# Altium project Time Circuit Control.PrjPcb
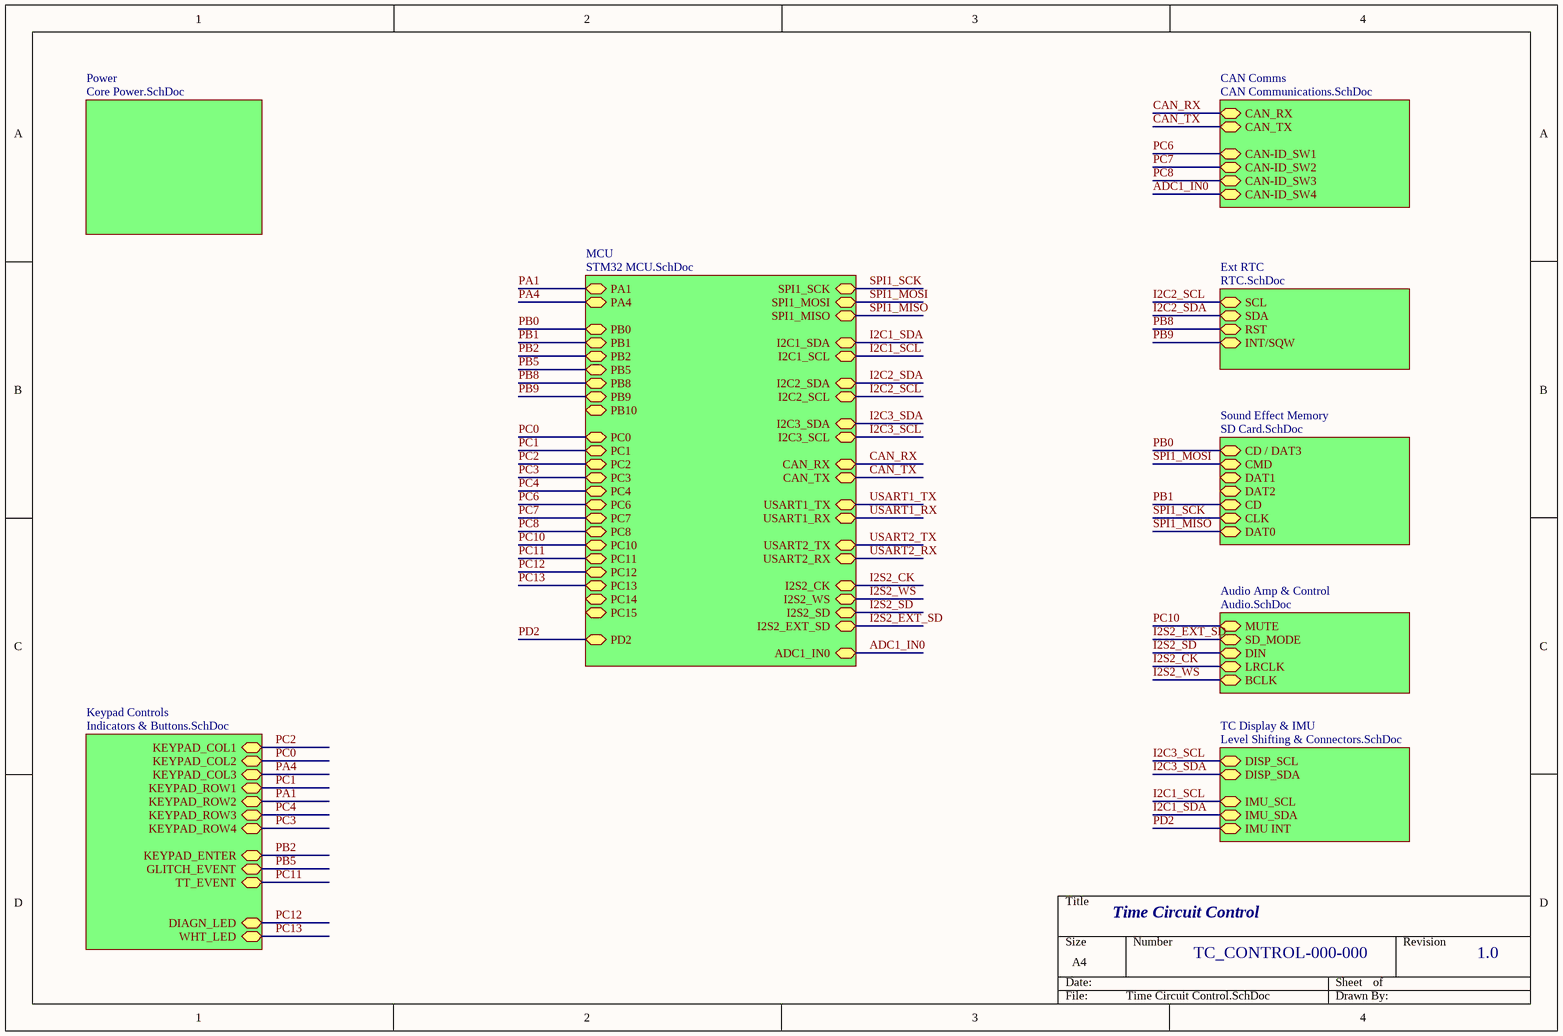
[diagram p0: Time Circuit Control.SchDoc]
9 sheets, 108 parts. Net scope: hierarchical (ports join the sheet entries above them; power ports are global).
Board file: Time Circuit Control.PcbDoc
Sheets:
  Time Circuit Control.SchDoc
    MCU = STM32 MCU.SchDoc
    CAN Comms = CAN Communications.SchDoc
    Ext RTC = RTC.SchDoc
    Power = Core Power.SchDoc
    Sound Effect Memory = SD Card.SchDoc
    Audio Amp & Control = Audio.SchDoc
    TC Display & IMU = Level Shifting & Connectors.SchDoc
    Keypad Controls = Indicators & Buttons.SchDoc

## Sheet Time Circuit Control.SchDoc
size A4; SheetNumber: 9; SheetTotal: 9

### Sub-sheets
Audio Amp & Control = Audio.SchDoc: DIN, SD_MODE, LRCLK, MUTE, BCLK
CAN Comms = CAN Communications.SchDoc: CAN_RX, CAN_TX, CAN-ID_SW1, CAN-ID_SW2, CAN-ID_SW3, CAN-ID_SW4
Ext RTC = RTC.SchDoc: SDA, RST, INT/SQW, SCL
Keypad Controls = Indicators & Buttons.SchDoc: KEYPAD_COL2, KEYPAD_ENTER, KEYPAD_COL1, GLITCH_EVENT, DIAGN_LED, KEYPAD_ROW2, KEYPAD_COL3, TT_EVENT, KEYPAD_ROW1, KEYPAD_ROW4, WHT_LED, KEYPAD_ROW3
MCU = STM32 MCU.SchDoc: SPI1_SCK, SPI1_MOSI, PA1, PA4, PC12, I2S2_CK, PC4, I2S2_WS, I2S2_SD, PD2, PC15, PC1, PC0, PC14, PC13, PB9, PB8, PC11, PC10, I2S2_EXT_SD, I2C1_SDA, I2C1_SCL, PB2, PB1, I2C2_SDA, I2C2_SCL, PB10, PB0, CAN_RX, CAN_TX, USART2_TX, PC7, PC8, I2C3_SDA, USART2_RX, PC6, I2C3_SCL, USART1_TX, USART1_RX, PB5, SPI1_MISO, PC3, PC2, ADC1_IN0
Power = Core Power.SchDoc: no entries
Sound Effect Memory = SD Card.SchDoc: CD / DAT3, CMD, DAT1, DAT2, CD, CLK, DAT0
TC Display & IMU = Level Shifting & Connectors.SchDoc: IMU INT, DISP_SDA, IMU_SDA, IMU_SCL, DISP_SCL

### Nets
ADC1_IN0: sheet MCU/ADC1_IN0, sheet CAN Comms/CAN-ID_SW4
CAN_RX: sheet MCU/CAN_RX, sheet CAN Comms/CAN_RX
CAN_TX: sheet MCU/CAN_TX, sheet CAN Comms/CAN_TX
I2C1_SCL: sheet MCU/I2C1_SCL, sheet TC Display & IMU/IMU_SCL
I2C1_SDA: sheet MCU/I2C1_SDA, sheet TC Display & IMU/IMU_SDA
I2C2_SCL: sheet MCU/I2C2_SCL, sheet Ext RTC/SCL
I2C2_SDA: sheet MCU/I2C2_SDA, sheet Ext RTC/SDA
I2C3_SCL: sheet MCU/I2C3_SCL, sheet TC Display & IMU/DISP_SCL
I2C3_SDA: sheet MCU/I2C3_SDA, sheet TC Display & IMU/DISP_SDA
I2S2_CK: sheet MCU/I2S2_CK, sheet Audio Amp & Control/LRCLK
I2S2_EXT_SD: sheet MCU/I2S2_EXT_SD, sheet Audio Amp & Control/SD_MODE
I2S2_SD: sheet MCU/I2S2_SD, sheet Audio Amp & Control/DIN
I2S2_WS: sheet MCU/I2S2_WS, sheet Audio Amp & Control/BCLK
PA1: sheet MCU/PA1, sheet Keypad Controls/KEYPAD_ROW2
PA4: sheet MCU/PA4, sheet Keypad Controls/KEYPAD_COL3
PB0: sheet MCU/PB0, sheet Sound Effect Memory/CD / DAT3
PB1: sheet MCU/PB1, sheet Sound Effect Memory/CD
PB2: sheet MCU/PB2, sheet Keypad Controls/KEYPAD_ENTER
PB5: sheet MCU/PB5, sheet Keypad Controls/GLITCH_EVENT
PB8: sheet MCU/PB8, sheet Ext RTC/RST
PB9: sheet MCU/PB9, sheet Ext RTC/INT/SQW
PC0: sheet MCU/PC0, sheet Keypad Controls/KEYPAD_COL2
PC1: sheet MCU/PC1, sheet Keypad Controls/KEYPAD_ROW1
PC2: sheet MCU/PC2, sheet Keypad Controls/KEYPAD_COL1
PC3: sheet MCU/PC3, sheet Keypad Controls/KEYPAD_ROW4
PC4: sheet MCU/PC4, sheet Keypad Controls/KEYPAD_ROW3
PC6: sheet MCU/PC6, sheet CAN Comms/CAN-ID_SW1
PC7: sheet MCU/PC7, sheet CAN Comms/CAN-ID_SW2
PC8: sheet MCU/PC8, sheet CAN Comms/CAN-ID_SW3
PC10: sheet MCU/PC10, sheet Audio Amp & Control/MUTE
PC11: sheet MCU/PC11, sheet Keypad Controls/TT_EVENT
PC12: sheet MCU/PC12, sheet Keypad Controls/DIAGN_LED
PC13: sheet MCU/PC13, sheet Keypad Controls/WHT_LED
PD2: sheet MCU/PD2, sheet TC Display & IMU/IMU INT
SPI1_MISO: sheet MCU/SPI1_MISO, sheet Sound Effect Memory/DAT0
SPI1_MOSI: sheet MCU/SPI1_MOSI, sheet Sound Effect Memory/CMD
SPI1_SCK: sheet MCU/SPI1_SCK, sheet Sound Effect Memory/CLK

### Notes on the sheet
- Time Circuit Control
- TC_CONTROL-000-000
- 1.0

## Sheet STM32 MCU.SchDoc
size A4; SheetNumber: 1; SheetTotal: 9
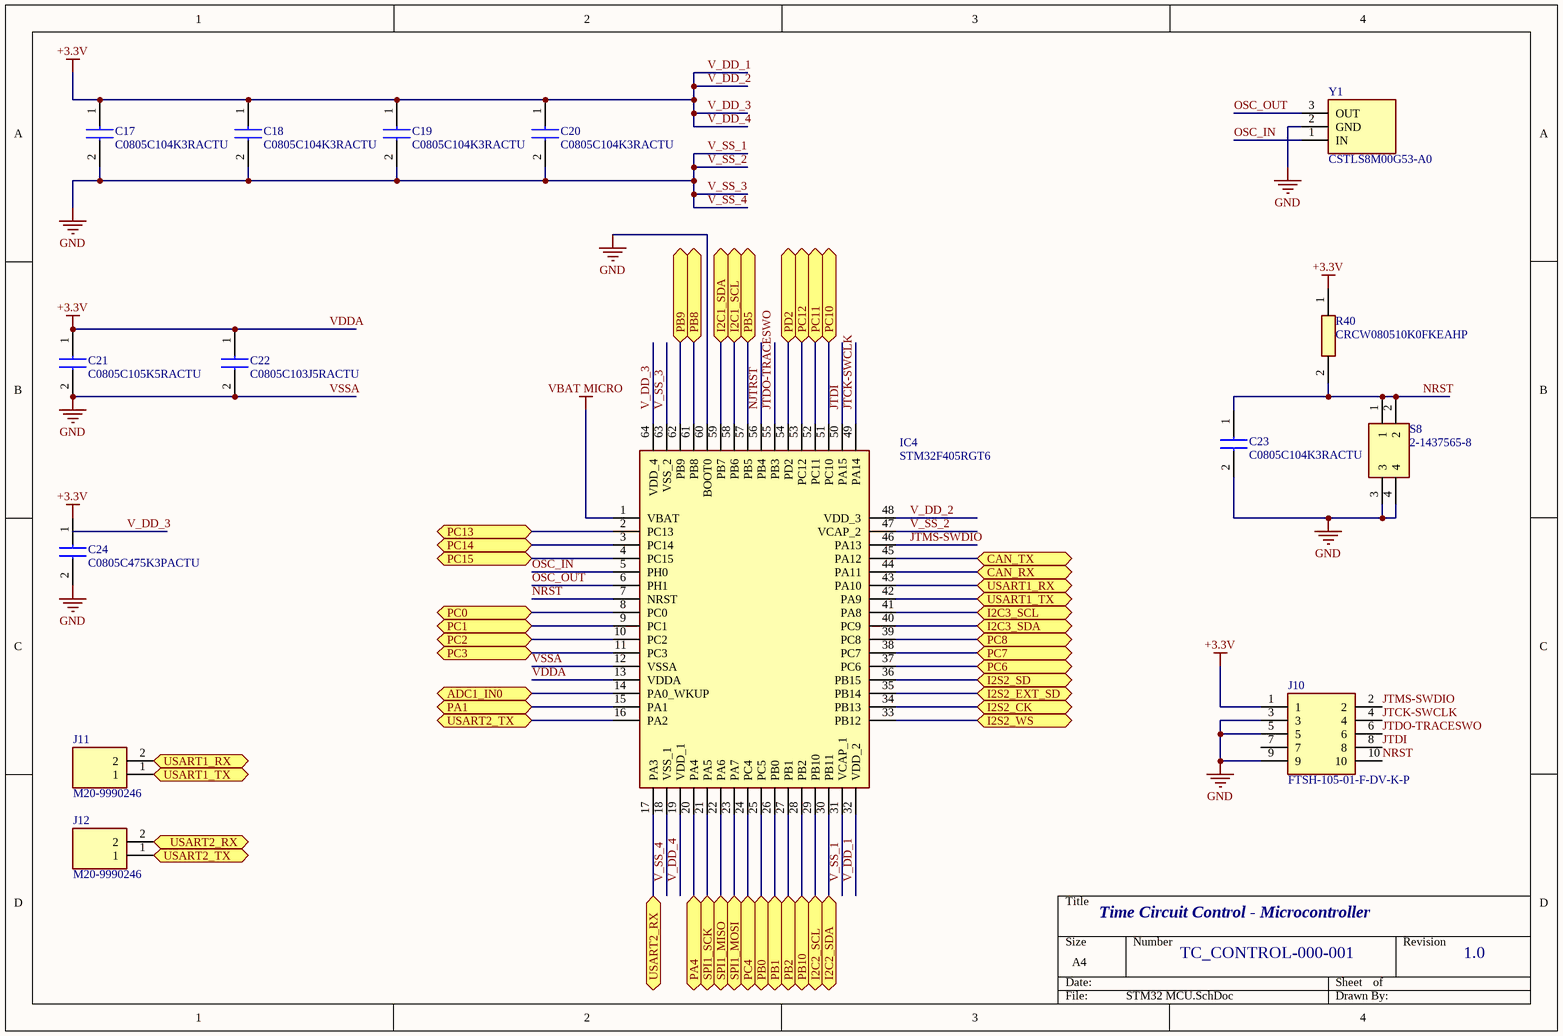
[diagram p1: STM32 MCU.SchDoc]

### Parts
C17  C0805C104K3RACTU  [CAPC2012X88N]
C18  C0805C104K3RACTU  [CAPC2012X88N]
C19  C0805C104K3RACTU  [CAPC2012X88N]
C20  C0805C104K3RACTU  [CAPC2012X88N]
C21  C0805C105K5RACTU  [CAPC2012X140N]
C22  C0805C103J5RACTU  [CAPC2012X88N]
C23  C0805C104K3RACTU  [CAPC2012X88N]
C24  C0805C475K3PACTU  [CAPC2013X140N]
IC4  STM32F405RGT6  [QFP50P1200X1200X160-64N]
J10  FTSH-105-01-F-DV-K-P  [FTSH-105-XX-YYY-DV-K-P]
J11  M20-9990246  [HDRV2W66P0X254_1X2_508X254X874P]
J12  M20-9990246  [HDRV2W66P0X254_1X2_508X254X874P]
R40  CRCW080510K0FKEAHP  [RESC2012X60N]
S8  2-1437565-8  [FSM2J_1]
Y1  CSTLS8M00G53-A0  [CSTLS8M00G53A0]

### Ports
ADC1_IN0, CAN_RX, CAN_TX, I2C1_SCL, I2C1_SDA, I2C2_SCL, I2C2_SDA, I2C3_SCL, I2C3_SDA, I2S2_CK, I2S2_EXT_SD, I2S2_SD, I2S2_WS, PA1, PA4, PB0, PB1, PB2, PB5, PB8, PB9, PB10, PC0, PC1, PC2, PC3, PC4, PC6, PC7, PC8, PC10, PC11, PC12, PC13, PC14, PC15, PD2, SPI1_MISO, SPI1_MOSI, SPI1_SCK, USART1_RX, USART1_TX, USART2_RX, USART2_TX

### Nets
V_DD_1: C17.1 C18.1 C19.1 C20.1 C21.1 C22.1 C24.1(C1) IC4.13(VDDA) IC4.19(VDD_1) IC4.32(VDD_2) IC4.48(VDD_3) IC4.64(VDD_4) J10.1 R40.1  [also labelled +3.3V, V_DD_2, V_DD_3, V_DD_4, VDDA]
V_SS_1: C17.2 C18.2 C19.2 C20.2 C21.2 C22.2 C23.2 C24.2(C2) IC4.12(VSSA) IC4.18(VSS_1) IC4.31(VCAP_1) IC4.47(VCAP_2) IC4.60(BOOT0) IC4.63(VSS_2) J10.3 J10.5 J10.9 S8.3 S8.4 Y1.2(GND)  [also labelled GND, V_SS_2, V_SS_3, V_SS_4, VSSA]
VBAT MICRO: IC4.1(VBAT)
ADC1_IN0: IC4.14(PA0_WKUP) ; port ADC1_IN0
CAN_RX: IC4.44(PA11) ; port CAN_RX
CAN_TX: IC4.45(PA12) ; port CAN_TX
I2C1_SCL: IC4.58(PB6) ; port I2C1_SCL
I2C1_SDA: IC4.59(PB7) ; port I2C1_SDA
I2C2_SCL: IC4.29(PB10) ; port I2C2_SCL
I2C2_SDA: IC4.30(PB11) ; port I2C2_SDA
I2C3_SCL: IC4.41(PA8) ; port I2C3_SCL
I2C3_SDA: IC4.40(PC9) ; port I2C3_SDA
I2S2_CK: IC4.34(PB13) ; port I2S2_CK
I2S2_EXT_SD: IC4.35(PB14) ; port I2S2_EXT_SD
I2S2_SD: IC4.36(PB15) ; port I2S2_SD
I2S2_WS: IC4.33(PB12) ; port I2S2_WS
JTCK-SWCLK: IC4.49(PA14) J10.4
JTDI: IC4.50(PA15) J10.8
JTDO-TRACESWO: IC4.55(PB3) J10.6
JTMS-SWDIO: IC4.46(PA13) J10.2
NJTRST: IC4.56(PB4)
NRST: C23.1 IC4.7(NRST) J10.10 R40.2 S8.1 S8.2
OSC_IN: IC4.5(PH0) Y1.1(IN)
OSC_OUT: IC4.6(PH1) Y1.3(OUT)
PA1: IC4.15(PA1) ; port PA1
PA4: IC4.20(PA4) ; port PA4
PB0: IC4.25(PC5) ; port PB0
PB1: IC4.26(PB0) ; port PB1
PB2: IC4.27(PB1) ; port PB2
PB5: IC4.57(PB5) ; port PB5
PB8: IC4.61(PB8) ; port PB8
PB9: IC4.62(PB9) ; port PB9
PC0: IC4.8(PC0) ; port PC0
PC1: IC4.9(PC1) ; port PC1
PC2: IC4.10(PC2) ; port PC2
PC3: IC4.11(PC3) ; port PC3
PC4: IC4.24(PC4) ; port PC4
PC6: IC4.37(PC6) ; port PC6
PC7: IC4.38(PC7) ; port PC7
PC8: IC4.39(PC8) ; port PC8
PC10: IC4.51(PC10) ; port PC10
PC11: IC4.52(PC11) ; port PC11
PC12: IC4.53(PC12) ; port PC12
PC13: IC4.2(PC13) ; port PC13
PD2: IC4.54(PD2) ; port PD2
SPI1_MISO: IC4.22(PA6) ; port SPI1_MISO
SPI1_MOSI: IC4.23(PA7) ; port SPI1_MOSI
SPI1_SCK: IC4.21(PA5) ; port SPI1_SCK
USART1_RX: IC4.43(PA10) J11.2 ; port USART1_RX
USART1_TX: IC4.42(PA9) J11.1 ; port USART1_TX
USART2_RX: IC4.17(PA3) J12.2 ; port USART2_RX
USART2_TX: IC4.16(PA2) J12.1 ; port USART2_TX
NetIC4_3: IC4.3(PC14) ; port PC14
NetIC4_4: IC4.4(PC15) ; port PC15
NetIC4_28: IC4.28(PB2) ; port PB10

Not connected (* = marked no-connect by the designer): J10 7

### Notes on the sheet
- Time Circuit Control - Microcontroller
- TC_CONTROL-000-001
- 1.0

### Library data of the parts
C17-C20 C23 = C0805C104K3RACTU: Capacitor; Manufacturer_Name: Kemet; Datasheet Link: https://componentsearchengine.com/Datasheets/2/C0805C104K3RACTU.pdf; Height: 0.88mm; Manufacturer_Part_Number: C0805C104K3RACTU; Mouser Part Number: 80-C0805C104K3R; Mouser Price/Stock: https://www.mouser.co.uk/ProductDetail/KEMET/C0805C104K3RACTU?qs=zZwvocWqSRjmUvfNxkIN%2Fg%3D%3D; Arrow Part Number: C0805C104K3RACTU; Arrow Price/Stock: https://www.arrow.com/en/products/c0805c104k3ractu/kemet-corporation
C21 = C0805C105K5RACTU: Capacitor; Manufacturer_Name: Kemet; Datasheet Link: http://www.kemet.com/docfinder?Partnumber=C0805C105K5RACTU; Height: 1.4mm; Manufacturer_Part_Number: C0805C105K5RACTU; Mouser Part Number: 80-C0805C105K5R; Mouser Price/Stock: https://www.mouser.co.uk/ProductDetail/KEMET/C0805C105K5RACTU/?qs=iP0bYSAMAFrBrUflcErrLQ%3D%3D; Arrow Part Number: C0805C105K5RACTU; Arrow Price/Stock: https://www.arrow.com/en/products/c0805c105k5ractu/kemet-corporation
C22 = C0805C103J5RACTU: Capacitor; Manufacturer_Name: Kemet; Datasheet Link: http://uk.rs-online.com/web/p/products/8029917; Height: 0.88mm; Manufacturer_Part_Number: C0805C103J5RACTU; Mouser Part Number: 80-C0805C103J5R; Mouser Price/Stock: https://www.mouser.co.uk/ProductDetail/KEMET/C0805C103J5RACTU/?qs=Onq5MIl0ZjiJ615hCkQQ7A%3D%3D; Arrow Part Number: C0805C103J5RACTU; Arrow Price/Stock: https://www.arrow.com/en/products/c0805c103j5ractu/kemet-corporation
C24 = C0805C475K3PACTU: Capacitor; Manufacturer_Name: Kemet; Manufacturer_Part_Number: C0805C475K3PACTU; Mouser Part Number: 80-C0805C475K3P; Mouser Price/Stock: https://www.mouser.co.uk/ProductDetail/KEMET/C0805C475K3PACTU?qs=K%2Fj%2Fqf%252B0fqKgIgOb3tBMNw%3D%3D; Arrow Part Number: C0805C475K3PACTU; Arrow Price/Stock: https://www.arrow.com/en/products/c0805c475k3pactu/kemet-corporation
IC4 = STM32F405RGT6: Integrated Circuit; Manufacturer_Name: STMicroelectronics; Datasheet Link: http://www.st.com/web/en/resource/technical/document/datasheet/DM00037051.pdf; Height: 1.6mm; Manufacturer_Part_Number: STM32F405RGT6; Mouser Part Number: 511-STM32F405RGT6; Mouser Price/Stock: https://www.mouser.co.uk/ProductDetail/STMicroelectronics/STM32F405RGT6?qs=Z8%252BeY1k3TIKgj7QWsYGpQw%3D%3D; Arrow Part Number: STM32F405RGT6; Arrow Price/Stock: https://www.arrow.com/en/products/stm32f405rgt6/stmicroelectronics?region=nac
J10 = FTSH-105-01-F-DV-K-P: Connector; Manufacturer_Name: SAMTEC; Datasheet Link: http://suddendocs.samtec.com/prints/ftsh-1xx-xx-xxx-dv-xxx-xxx-mkt.pdf; Manufacturer_Part_Number: FTSH-105-01-F-DV-K-P; Mouser Part Number: 200-FTSH10501FDVKP; Mouser Price/Stock: https://www.mouser.co.uk/ProductDetail/Samtec/FTSH-105-01-F-DV-K-P/?qs=0lQeLiL1qybhAFeR%252BoRWyg%3D%3D; Arrow Part Number: FTSH-105-01-F-DV-K-P; Arrow Price/Stock: https://www.arrow.com/en/products/ftsh-105-01-f-dv-k-p/samtec
J11 J12 = M20-9990246: Connector; Manufacturer_Name: Harwin; Datasheet Link: https://cdn.harwin.com/pdfs/M20-999.pdf; Height: 8.74mm; Manufacturer_Part_Number: M20-9990246; Mouser Part Number: 855-M20-9990246; Mouser Price/Stock: https://www.mouser.co.uk/ProductDetail/Harwin/M20-9990246?qs=Jph8NoUxIfWjw4WmyRvzag%3D%3D
R40 = CRCW080510K0FKEAHP: Resistor; Manufacturer_Name: Vishay; Datasheet Link: https://componentsearchengine.com/Datasheets/1/CRCW08051R00FKEAHP.pdf; Height: 0.6mm; Manufacturer_Part_Number: CRCW080510K0FKEAHP; Mouser Part Number: 71-CRCW080510K0FKEAH; Mouser Price/Stock: https://www.mouser.co.uk/ProductDetail/Vishay-Dale/CRCW080510K0FKEAHP/?qs=FlFvgi4rxBybVOW6oiRQjA%3D%3D; Arrow Part Number: CRCW080510K0FKEAHP; Arrow Price/Stock: https://www.arrow.com/en/products/crcw080510k0fkeahp/vishay
S8 = 2-1437565-8: Switch; Manufacturer_Name: TE Connectivity; Datasheet Link: https://componentsearchengine.com/Datasheets/1/2-1437565-8.pdf; Manufacturer_Part_Number: 2-1437565-8; Mouser Part Number: 506-2-1437565-8; Mouser Price/Stock: https://www.mouser.co.uk/ProductDetail/TE-Connectivity-PB/2-1437565-8/?qs=%2FwXgF%2FfIho9gWJ5kkeMo7w%3D%3D; Arrow Part Number: 2-1437565-8; Arrow Price/Stock: https://www.arrow.com/en/products/2-1437565-8/te-connectivity
Y1 = CSTLS8M00G53-A0: Crystal or Oscillator; Manufacturer_Name: Murata Electronics; Datasheet Link: https://www.murata.com/en-us/api/pdfdownloadapi?cate=cgsubResonators&partno=CSTLS8M00G53-A0; Height: 6.7mm; Manufacturer_Part_Number: CSTLS8M00G53-A0; Mouser Part Number: 81-CSTLS8M00G53-A0; Mouser Price/Stock: https://www.mouser.com/Search/Refine.aspx?Keyword=81-CSTLS8M00G53-A0; Arrow Part Number: CSTLS8M00G53-A0; Arrow Price/Stock: https://www.arrow.com/en/products/cstls8m00g53-a0/murata-manufacturing

## Sheet CAN Communications.SchDoc
size A4; SheetNumber: 2; SheetTotal: 9
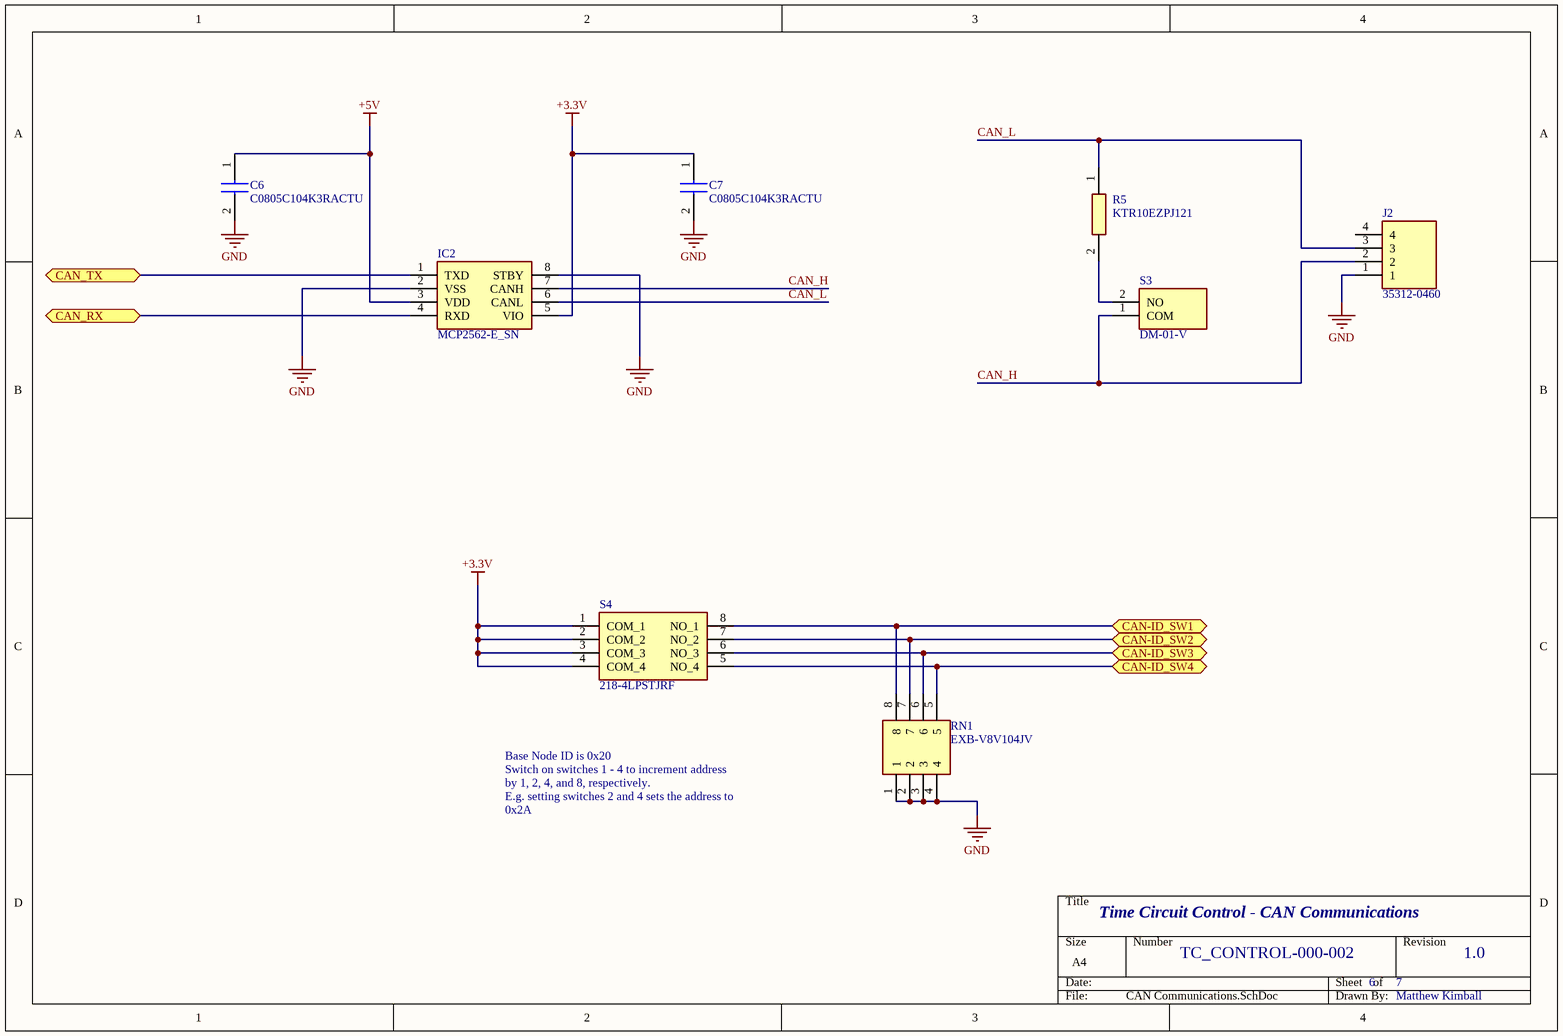
[diagram p2: CAN Communications.SchDoc]

### Parts
C6  C0805C104K3RACTU  [CAPC2012X88N]
C7  C0805C104K3RACTU  [CAPC2012X88N]
IC2  MCP2562-E_SN  [SOIC127P600X175-8N]
J2  35312-0460  [SHDR4W64P0X250_1X4_1246X650X700P]
R5  KTR10EZPJ121  [RESC2012X65N]
RN1  EXB-V8V104JV  [EXBV8V104JV]
S3  DM-01-V  [DM01V]
S4  218-4LPSTJRF  [2184LPSTJRF]

### Ports
CAN-ID_SW1, CAN-ID_SW2, CAN-ID_SW3, CAN-ID_SW4, CAN_RX, CAN_TX

### Nets
+3.3V: C7.1 IC2.5(VIO) S4.1(COM_1) S4.2(COM_2) S4.3(COM_3) S4.4(COM_4)  [project net V_DD_1]
+5V: C6.1 IC2.3(VDD)
GND: C6.2 C7.2 IC2.2(VSS) IC2.8(STBY) J2.1 RN1.1 RN1.2 RN1.3 RN1.4  [project net V_SS_1]
ADC1_IN0: RN1.5 S4.5(NO_4) ; port CAN-ID_SW4
CAN_H: IC2.7(CANH) J2.2 S3.1(COM)
CAN_L: IC2.6(CANL) J2.3 R5.1
CAN_RX: IC2.4(RXD) ; port CAN_RX
CAN_TX: IC2.1(TXD) ; port CAN_TX
PC6: RN1.8 S4.8(NO_1) ; port CAN-ID_SW1
PC7: RN1.7 S4.7(NO_2) ; port CAN-ID_SW2
PC8: RN1.6 S4.6(NO_3) ; port CAN-ID_SW3
NetR5_2: R5.2 S3.2(NO)

Not connected (* = marked no-connect by the designer): J2 4

### Notes on the sheet
- Base Node ID is 0x20
  Switch on switches 1 - 4 to increment address by 1, 2, 4, and 8, respectively.
  E.g. setting switches 2 and 4 sets the address to 0x2A
- Time Circuit Control - CAN Communications
- TC_CONTROL-000-002
- 6
- 7
- 1.0
- Matthew Kimball

### Library data of the parts
C6 C7 = C0805C104K3RACTU: Capacitor; Manufacturer_Name: Kemet; Datasheet Link: https://componentsearchengine.com/Datasheets/2/C0805C104K3RACTU.pdf; Height: 0.88mm; Manufacturer_Part_Number: C0805C104K3RACTU; Mouser Part Number: 80-C0805C104K3R; Mouser Price/Stock: https://www.mouser.co.uk/ProductDetail/KEMET/C0805C104K3RACTU?qs=zZwvocWqSRjmUvfNxkIN%2Fg%3D%3D; Arrow Part Number: C0805C104K3RACTU; Arrow Price/Stock: https://www.arrow.com/en/products/c0805c104k3ractu/kemet-corporation
IC2 = MCP2562-E_SN: Integrated Circuit; Manufacturer_Name: Microchip; Manufacturer_Part_Number: MCP2562-E/SN; Datasheet Link: http://docs-emea.rs-online.com/webdocs/12a8/0900766b812a88df.pdf; Height: 1.75mm; Mouser Part Number: 579-MCP2562-E/SN; Mouser Price/Stock: https://www.mouser.co.uk/ProductDetail/Microchip-Technology/MCP2562-E-SN?qs=6qKXPk0vzx3LlPUMCCw%252BCg%3D%3D; Arrow Part Number: MCP2562-E/SN; Arrow Price/Stock: https://www.arrow.com/en/products/mcp2562-esn/microchip-technology
J2 = 35312-0460: Connector; Manufacturer_Name: Molex; Datasheet Link: https://www.molex.com/pdm_docs/sd/353120460_sd.pdf; Height: 7mm; Manufacturer_Part_Number: 35312-0460; Mouser Part Number: 538-35312-0460; Mouser Price/Stock: https://www.mouser.co.uk/ProductDetail/Molex/35312-0460?qs=K5bGVUuM57oIWvCwIBpyrQ%3D%3D
R5 = KTR10EZPJ121: Resistor; Manufacturer_Name: ROHM Semiconductor; Datasheet Link: http://rohmfs.rohm.com/en/products/databook/datasheet/passive/resistor/chip_resistor/ktr.pdf; Height: 0.65mm; Manufacturer_Part_Number: KTR10EZPJ121; Mouser Part Number: 755-KTR10EZPJ121; Mouser Price/Stock: https://www.mouser.com/Search/Refine.aspx?Keyword=755-KTR10EZPJ121
RN1 = EXB-V8V104JV: Resistor Network; Manufacturer_Name: Panasonic; Datasheet Link: https://componentsearchengine.com/Datasheets/1/EXB-V8V104JV.pdf; Height: 0.7mm; Manufacturer_Part_Number: EXB-V8V104JV; Mouser Part Number: 667-EXB-V8V104JV; Mouser Price/Stock: https://www.mouser.co.uk/ProductDetail/Panasonic/EXB-V8V104JV?qs=uA7cY%2Fh6FfVDI8hHUId4hQ%3D%3D; Arrow Part Number: EXB-V8V104JV; Arrow Price/Stock: https://www.arrow.com/en/products/exbv8v104jv/panasonic
S3 = DM-01-V: Switch; Manufacturer_Name: Diptronics; Datasheet Link: https://componentsearchengine.com/Datasheets/1/DM-01-V.pdf; Height: 3.91mm; Manufacturer_Part_Number: DM-01-V; Mouser Part Number: 113-DM01V; Mouser Price/Stock: https://www.mouser.co.uk/ProductDetail/Diptronics/DM-01-V?qs=MLItCLRbWswAak4sKQLihA%3D%3D
S4 = 218-4LPSTJRF: Switch; Manufacturer_Name: CTS; Datasheet Link: https://www.ctscorp.com/wp-content/uploads/218.pdf; Height: 2.7mm; Manufacturer_Part_Number: 218-4LPSTJRF; Mouser Part Number: 774-218-4LPSTJRF; Mouser Price/Stock: https://www.mouser.co.uk/ProductDetail/CTS-Electronic-Components/218-4LPSTJRF?qs=6E8igxPflKcofnEJZWfCHQ%3D%3D; Arrow Part Number: 218-4LPSTJRF; Arrow Price/Stock: https://www.arrow.com/en/products/218-4lpstjrf/cts

## Sheet RTC.SchDoc
size A4; SheetNumber: 6; SheetTotal: 9
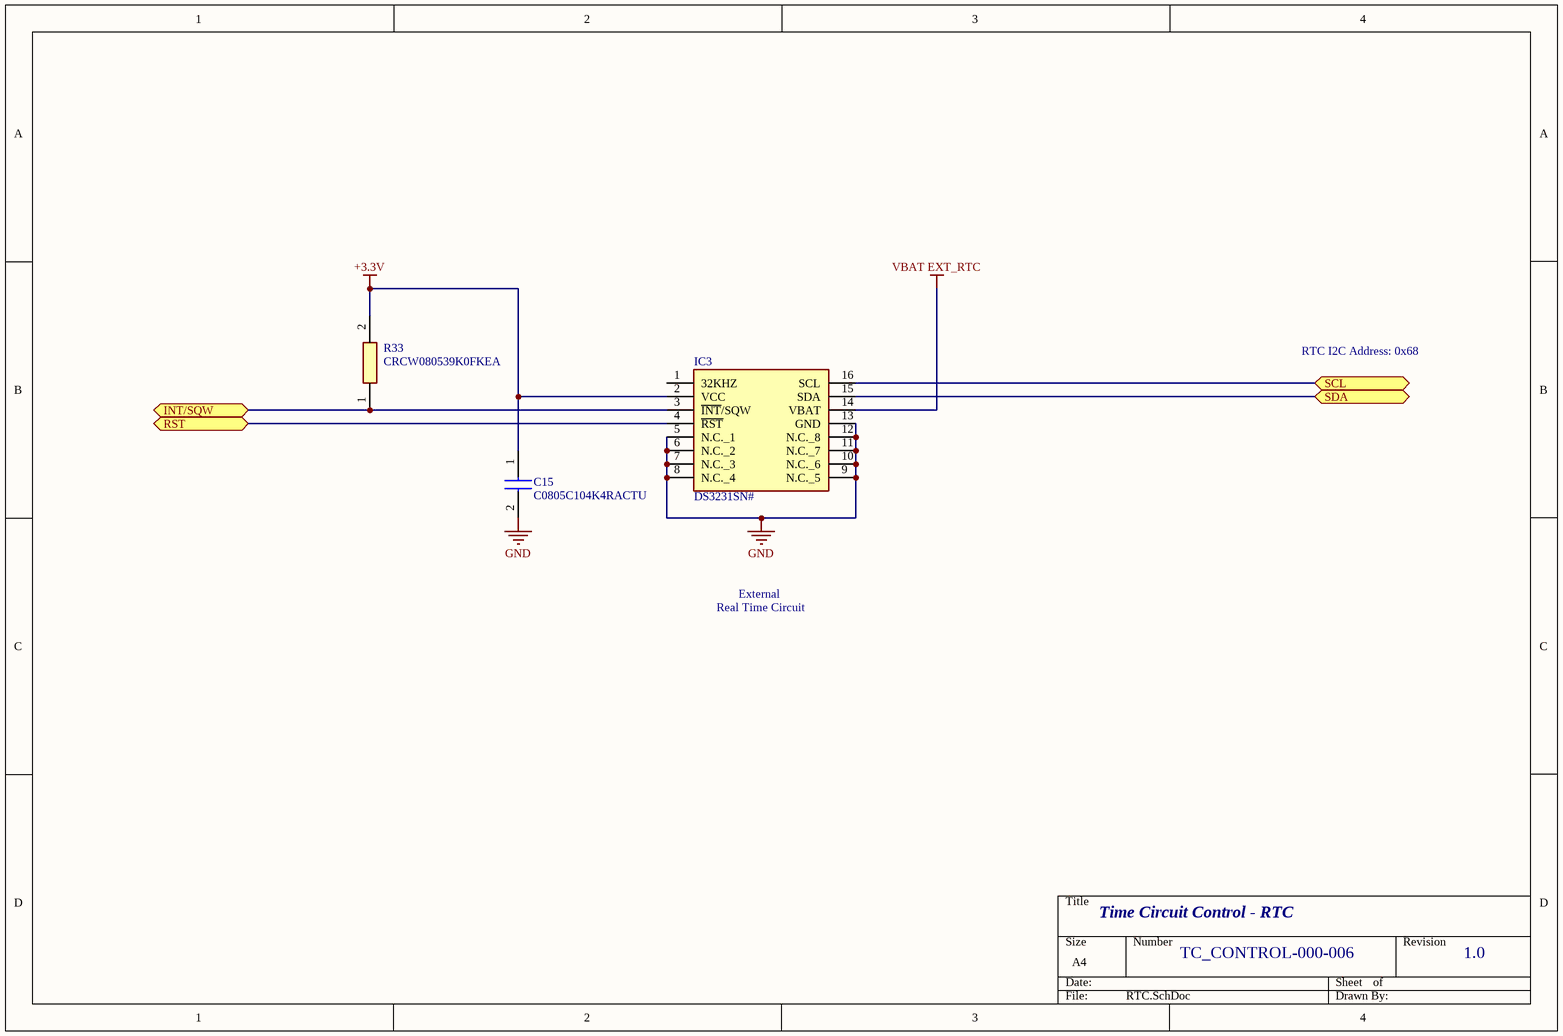
[diagram p3: RTC.SchDoc]

### Parts
C15  C0805C104K4RACTU  [CAPC2012X88N]
IC3  DS3231SN#  [SOIC127P1032X265-16N]
R33  CRCW080539K0FKEA  [RESC2012X50N]

### Ports
INT/SQW, RST, SCL, SDA

### Nets
+3.3V: C15.1 IC3.2(VCC) R33.2  [project net V_DD_1]
GND: C15.2 IC3.5(N.C._1) IC3.6(N.C._2) IC3.7(N.C._3) IC3.8(N.C._4) IC3.9(N.C._5) IC3.10(N.C._6) IC3.11(N.C._7) IC3.12(N.C._8) IC3.13(GND)  [project net V_SS_1]
VBAT EXT_RTC: IC3.14(VBAT)
I2C2_SCL: IC3.16(SCL) ; port SCL
I2C2_SDA: IC3.15(SDA) ; port SDA
PB8: IC3.4(~{RST}) ; port RST
PB9: IC3.3(~{INT}/SQW) R33.1 ; port INT/SQW

Not connected (* = marked no-connect by the designer): IC3 1(32KHZ)

### Notes on the sheet
- RTC I2C Address: 0x68
- External
  Real Time Circuit
- Time Circuit Control - RTC
- TC_CONTROL-000-006
- 1.0

### Library data of the parts
C15 = C0805C104K4RACTU: Capacitor; Manufacturer_Name: Kemet; Datasheet Link: http://docs-emea.rs-online.com/webdocs/134c/0900766b8134ce68.pdf; Height: 0.88mm; Manufacturer_Part_Number: C0805C104K4RACTU; Arrow Part Number: C0805C104K4RACTU; Arrow Price/Stock: https://www.arrow.com/en/products/c0805c104k4ractu/kemet-corporation; Mouser Part Number: 80-C0805C104K4R; Mouser Price/Stock: https://www.mouser.co.uk/ProductDetail/KEMET/C0805C104K4RACTU?qs=Pc30aiB8zWWfqQNJWggt%252BA%3D%3D
IC3 = DS3231SN#: Integrated Circuit; Manufacturer_Name: Maxim Integrated; Datasheet Link: https://datasheets.maximintegrated.com/en/ds/DS3231.pdf; Height: 2.65mm; Manufacturer_Part_Number: DS3231SN#; Mouser Part Number: 700-DS3231SN#; Mouser Price/Stock: https://www.mouser.co.uk/ProductDetail/Maxim-Integrated/DS3231SN?qs=1eQvB6Dk1vhUlr8%2FOrV0Fw%3D%3D; Arrow Part Number: DS3231SN#; Arrow Price/Stock: https://www.arrow.com/en/products/ds3231sn/maxim-integrated?region=nac
R33 = CRCW080539K0FKEA: Resistor; Manufacturer_Name: Vishay; Datasheet Link: http://www.vishay.com/docs/20035/dcrcwe3.pdf; Height: 0.5mm; Manufacturer_Part_Number: CRCW080539K0FKEA; Arrow Part Number: CRCW080539K0FKEA; Mouser Part Number: 71-CRCW080539K0FKEA; Mouser Price/Stock: https://www.mouser.co.uk/ProductDetail/Vishay-Dale/CRCW080539K0FKEA?qs=kJXytlGtIWlXWBq67QQPjA%3D%3D

## Sheet Core Power.SchDoc
size A4; SheetNumber: 3; SheetTotal: 9
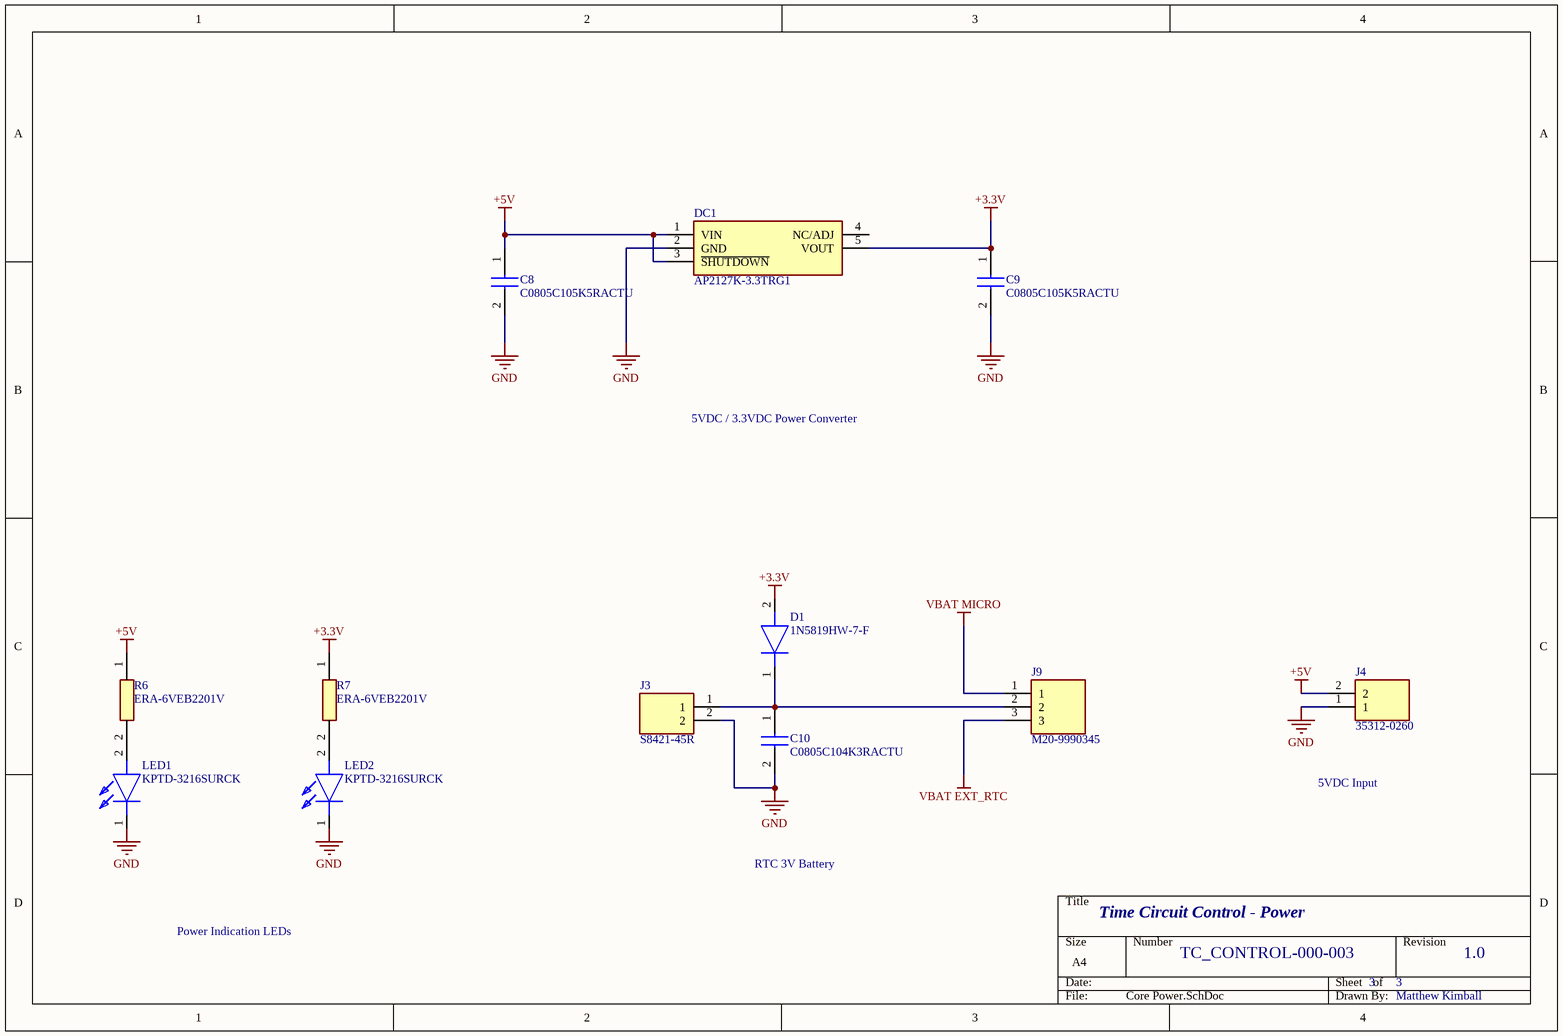
[diagram p4: Core Power.SchDoc]

### Parts
C8  C0805C105K5RACTU  [CAPC2012X140N]
C9  C0805C105K5RACTU  [CAPC2012X140N]
C10  C0805C104K3RACTU  [CAPC2012X88N]
D1  1N5819HW-7-F  [SOD3716X125N]
DC1  AP2127K-3.3TRG1  [SOT95P282X145-5N]
J3  S8421-45R  [S8421-45R_1]
J4  35312-0260  [SHDR2W64P0X250_1X2_746X650X700P]
J9  M20-9990345  [HDRV3W64P0X254_1X3_762X254X864P]
LED1  KPTD-3216SURCK  [KPTD3216SURCK]
LED2  KPTD-3216SURCK  [KPTD3216SURCK]
R6  ERA-6VEB2201V  [RESC2012X65N]
R7  ERA-6VEB2201V  [RESC2012X65N]

### Nets
+3.3V: C9.1 D1.2(A) DC1.5(VOUT) R7.1  [project net V_DD_1]
+5V: C8.1 DC1.1(VIN) DC1.3(~{SHUTDOWN}) J4.2 R6.1
GND: C8.2 C9.2 C10.2 DC1.2(GND) J3.2 J4.1 LED1.1(K) LED2.1(K)  [project net V_SS_1]
VBAT EXT_RTC: J9.3
VBAT MICRO: J9.1
NetC10_1: C10.1 D1.1(K) J3.1 J9.2
NetLED1_2: LED1.2(A) R6.2
NetLED2_2: LED2.2(A) R7.2

Not connected (* = marked no-connect by the designer): DC1 4(NC/ADJ)

### Notes on the sheet
- 5VDC / 3.3VDC Power Converter
- 5VDC Input
- RTC 3V Battery
- Time Circuit Control - Power
- Power Indication LEDs
- TC_CONTROL-000-003
- 3
- 1.0
- Matthew Kimball

### Library data of the parts
C8 C9 = C0805C105K5RACTU: Capacitor; Manufacturer_Name: Kemet; Datasheet Link: http://www.kemet.com/docfinder?Partnumber=C0805C105K5RACTU; Height: 1.4mm; Manufacturer_Part_Number: C0805C105K5RACTU; Mouser Part Number: 80-C0805C105K5R; Mouser Price/Stock: https://www.mouser.co.uk/ProductDetail/KEMET/C0805C105K5RACTU/?qs=iP0bYSAMAFrBrUflcErrLQ%3D%3D; Arrow Part Number: C0805C105K5RACTU; Arrow Price/Stock: https://www.arrow.com/en/products/c0805c105k5ractu/kemet-corporation
C10 = C0805C104K3RACTU: Capacitor; Manufacturer_Name: Kemet; Datasheet Link: https://componentsearchengine.com/Datasheets/2/C0805C104K3RACTU.pdf; Height: 0.88mm; Manufacturer_Part_Number: C0805C104K3RACTU; Mouser Part Number: 80-C0805C104K3R; Mouser Price/Stock: https://www.mouser.co.uk/ProductDetail/KEMET/C0805C104K3RACTU?qs=zZwvocWqSRjmUvfNxkIN%2Fg%3D%3D; Arrow Part Number: C0805C104K3RACTU; Arrow Price/Stock: https://www.arrow.com/en/products/c0805c104k3ractu/kemet-corporation
D1 = 1N5819HW-7-F: Diode; Manufacturer_Name: MULTICOMP; Datasheet Link: http://www.farnell.com/datasheets/1693720.pdf; Height: 1.25mm; Manufacturer_Part_Number: 1N5819HW-7-F
DC1 = AP2127K-3.3TRG1: Integrated Circuit; Manufacturer_Name: Diodes Inc.; Datasheet Link: https://www.diodes.com/assets/Datasheets/AP2127.pdf; Height: 1.45mm; Manufacturer_Part_Number: AP2127K-3.3TRG1; Mouser Part Number: 621-AP2127K-3.3TRG1; Mouser Price/Stock: https://www.mouser.co.uk/ProductDetail/Diodes-Incorporated/AP2127K-33TRG1?qs=x6A8l6qLYDCeAxisWuFs5g%3D%3D; Arrow Part Number: AP2127K-3.3TRG1; Arrow Price/Stock: https://www.arrow.com/en/products/ap2127k-3.3trg1/diodes-incorporated
J3 = S8421-45R: Connector; Manufacturer_Name: Harwin; Datasheet Link: https://datasheet.datasheetarchive.com/originals/distributors/Datasheets-DGA1/157350.pdf; Manufacturer_Part_Number: S8421-45R; Mouser Part Number: 855-S8421-45R; Mouser Price/Stock: https://www.mouser.co.uk/ProductDetail/Harwin/S8421-45R?qs=Qom7kyPojXY6z0Gmx3V3RQ%3D%3D
J4 = 35312-0260: Connector; Manufacturer_Name: Molex; Datasheet Link: https://www.molex.com/pdm_docs/sd/353120260_sd.pdf; Height: 7mm; Manufacturer_Part_Number: 35312-0260; Mouser Part Number: 538-35312-0260; Mouser Price/Stock: https://www.mouser.co.uk/ProductDetail/Molex/35312-0260?qs=yk4OKw9K9iIhFPrGnuA8uA%3D%3D
J9 = M20-9990345: Connector; Manufacturer_Name: Harwin; Description: 2.54 pitch SIL vertical PC tail pin header; Datasheet Link: https://cdn.harwin.com/pdfs/M20-999.pdf; Height: 8.64mm; Manufacturer_Part_Number: M20-9990345; Mouser Part Number: 855-M20-9990345; Mouser Price/Stock: https://www.mouser.co.uk/ProductDetail/Harwin/M20-9990345?qs=ulE8k0yEMYbl6ZPCtNdmpA%3D%3D
LED1 LED2 = KPTD-3216SURCK: LED; Manufacturer_Name: Kingbright; Datasheet Link: https://www.mouser.com/catalog/specsheets/kingbright_kbec-s-a0008346162-1.pdf; Height: 1.8mm; Manufacturer_Part_Number: KPTD-3216SURCK; Mouser Part Number: N/A; Mouser Price/Stock: https://www.mouser.com/Search/Refine.aspx?Keyword=N%2FA; Arrow Part Number: KPTD-3216SURCK; Arrow Price/Stock: https://www.arrow.com/en/products/kptd-3216surck/kingbright
R6 R7 = ERA-6VEB2201V: Resistor; Manufacturer_Name: Panasonic; Datasheet Link: https://www.mouser.de/datasheet/2/315/Panasonic_Resistor_Thin_Film_(ERA-xV_2c_ERA-xK_Ser-1815278.pdf; Height: 0.65mm; Manufacturer_Part_Number: ERA-6VEB2201V; Mouser Part Number: 667-ERA-6VEB2201V; Mouser Price/Stock: https://www.mouser.co.uk/ProductDetail/Panasonic/ERA-6VEB2201V?qs=rI7uf1IzohTwRzvkINayfg%3D%3D; Arrow Part Number: ERA-6VEB2201V; Arrow Price/Stock: https://www.arrow.com/en/products/era-6veb2201v/panasonic

## Sheet SD Card.SchDoc
size A4; SheetNumber: 7; SheetTotal: 9
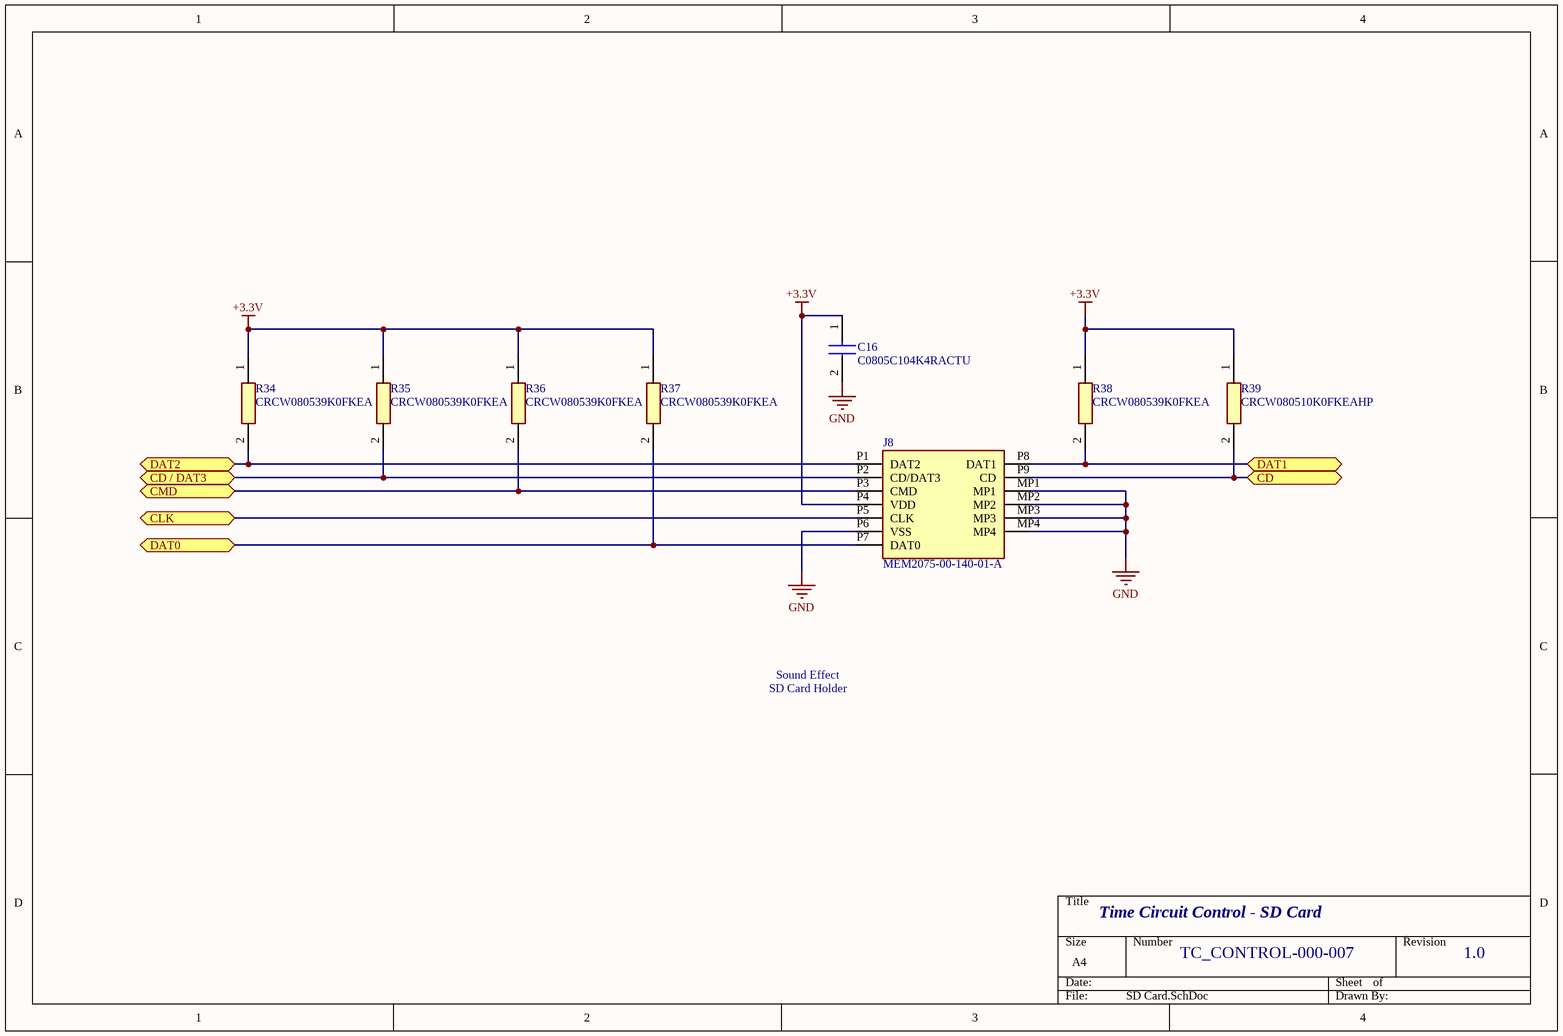
[diagram p5: SD Card.SchDoc]

### Parts
C16  C0805C104K4RACTU  [CAPC2012X88N]
J8  MEM2075-00-140-01-A  [MEM20750014001A]
R34  CRCW080539K0FKEA  [RESC2012X50N]
R35  CRCW080539K0FKEA  [RESC2012X50N]
R36  CRCW080539K0FKEA  [RESC2012X50N]
R37  CRCW080539K0FKEA  [RESC2012X50N]
R38  CRCW080539K0FKEA  [RESC2012X50N]
R39  CRCW080510K0FKEAHP  [RESC2012X60N]

### Ports
CD, CD / DAT3, CLK, CMD, DAT0, DAT1, DAT2

### Nets
+3.3V: C16.1 J8.P4(VDD) R34.1 R35.1 R36.1 R37.1 R38.1 R39.1  [project net V_DD_1]
GND: C16.2 J8.MP1 J8.MP2 J8.MP3 J8.MP4 J8.P6(VSS)  [project net V_SS_1]
PB0: J8.P2(CD/DAT3) R35.2 ; port CD / DAT3
PB1: J8.P9(CD) R39.2 ; port CD
SPI1_MISO: J8.P7(DAT0) R37.2 ; port DAT0
SPI1_MOSI: J8.P3(CMD) R36.2 ; port CMD
SPI1_SCK: J8.P5(CLK) ; port CLK
NetJ8_P1: J8.P1(DAT2) R34.2 ; port DAT2
NetJ8_P8: J8.P8(DAT1) R38.2 ; port DAT1

### Notes on the sheet
- Sound Effect
  SD Card Holder
- Time Circuit Control - SD Card
- TC_CONTROL-000-007
- 1.0

### Library data of the parts
C16 = C0805C104K4RACTU: Capacitor; Manufacturer_Name: Kemet; Datasheet Link: http://docs-emea.rs-online.com/webdocs/134c/0900766b8134ce68.pdf; Height: 0.88mm; Manufacturer_Part_Number: C0805C104K4RACTU; Arrow Part Number: C0805C104K4RACTU; Arrow Price/Stock: https://www.arrow.com/en/products/c0805c104k4ractu/kemet-corporation; Mouser Part Number: 80-C0805C104K4R; Mouser Price/Stock: https://www.mouser.co.uk/ProductDetail/KEMET/C0805C104K4RACTU?qs=Pc30aiB8zWWfqQNJWggt%252BA%3D%3D
J8 = MEM2075-00-140-01-A: Connector; Manufacturer_Name: GCT (GLOBAL CONNECTOR TECHNOLOGY); Datasheet Link: http://www.farnell.com/cad/2606866.pdf; Height: 1.45mm; Manufacturer_Part_Number: MEM2075-00-140-01-A; Mouser Part Number: 640-MEM20750014001A; Mouser Price/Stock: https://www.mouser.co.uk/ProductDetail/GCT/MEM2075-00-140-01-A?qs=KUoIvG%2F9IlZvfWpeERlq3Q%3D%3D
R34-R38 = CRCW080539K0FKEA: Resistor; Manufacturer_Name: Vishay; Datasheet Link: http://www.vishay.com/docs/20035/dcrcwe3.pdf; Height: 0.5mm; Manufacturer_Part_Number: CRCW080539K0FKEA; Arrow Part Number: CRCW080539K0FKEA; Mouser Part Number: 71-CRCW080539K0FKEA; Mouser Price/Stock: https://www.mouser.co.uk/ProductDetail/Vishay-Dale/CRCW080539K0FKEA?qs=kJXytlGtIWlXWBq67QQPjA%3D%3D
R39 = CRCW080510K0FKEAHP: Resistor; Manufacturer_Name: Vishay; Datasheet Link: https://componentsearchengine.com/Datasheets/1/CRCW08051R00FKEAHP.pdf; Height: 0.6mm; Manufacturer_Part_Number: CRCW080510K0FKEAHP; Mouser Part Number: 71-CRCW080510K0FKEAH; Mouser Price/Stock: https://www.mouser.co.uk/ProductDetail/Vishay-Dale/CRCW080510K0FKEAHP/?qs=FlFvgi4rxBybVOW6oiRQjA%3D%3D; Arrow Part Number: CRCW080510K0FKEAHP; Arrow Price/Stock: https://www.arrow.com/en/products/crcw080510k0fkeahp/vishay

## Sheet Audio.SchDoc
size A4; SheetNumber: 5; SheetTotal: 9
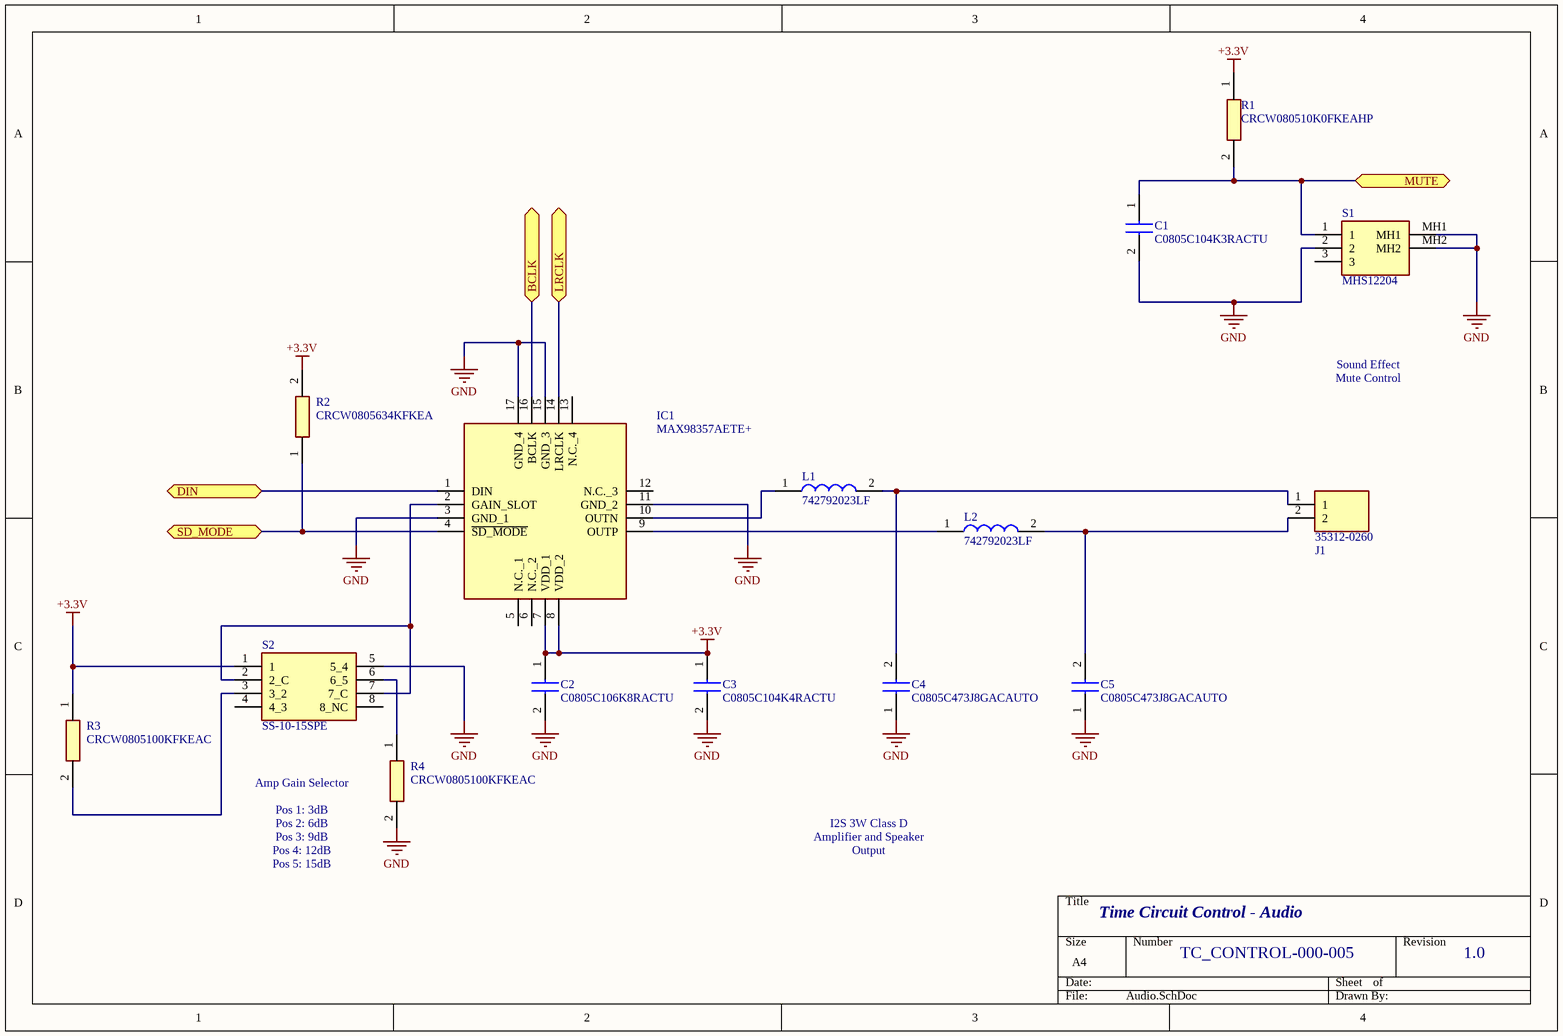
[diagram p6: Audio.SchDoc]

### Parts
C1  C0805C104K3RACTU  [CAPC2012X88N]
C2  C0805C106K8RACTU  [C0805]
C3  C0805C104K4RACTU  [CAPC2012X88N]
C4  C0805C473J8GACAUTO  [C0805]
C5  C0805C473J8GACAUTO  [C0805]
IC1  MAX98357AETE+  [QFN50P300X300X80-17N]
J1  35312-0260  [SHDR2W64P0X250_1X2_746X650X700P]
L1  742792023LF  [CAPC2012X110N]
L2  742792023LF  [CAPC2012X110N]
R1  CRCW080510K0FKEAHP  [RESC2012X60N]
R2  CRCW0805634KFKEA  [RESC2012X50N]
R3  CRCW0805100KFKEAC  [RESC2012X60N]
R4  CRCW0805100KFKEAC  [RESC2012X60N]
S1  MHS12204  [MHS12204]
S2  SS-10-15SPE  [SS1015SPE]

### Ports
BCLK, DIN, LRCLK, MUTE, SD_MODE

### Nets
+3.3V: C2.1 C3.1 IC1.7(VDD_1) IC1.8(VDD_2) R1.1 R2.2 R3.1 S2.1  [project net V_DD_1]
GND: C1.2 C2.2 C3.2 C4.1 C5.1 IC1.3(GND_1) IC1.11(GND_2) IC1.15(GND_3) IC1.17(GND_4) R4.2 S1.2 S1.MH1 S1.MH2 S2.5(5_4)  [project net V_SS_1]
I2S2_CK: IC1.14(LRCLK) ; port LRCLK
I2S2_EXT_SD: IC1.4(~{SD_MODE}) R2.1 ; port SD_MODE
I2S2_SD: IC1.1(DIN) ; port DIN
I2S2_WS: IC1.16(BCLK) ; port BCLK
PC10: C1.1 R1.2 S1.1 ; port MUTE
NetC4_2: C4.2 J1.1 L1.2
NetC5_2: C5.2 J1.2 L2.2
NetIC1_2: IC1.2(GAIN_SLOT) S2.2(2_C) S2.7(7_C)
NetIC1_9: IC1.9(OUTP) L2.1
NetIC1_10: IC1.10(OUTN) L1.1
NetR3_2: R3.2 S2.3(3_2)
NetR4_1: R4.1 S2.6(6_5)

Not connected (* = marked no-connect by the designer): IC1 5(N.C._1) 6(N.C._2) 12(N.C._3) 13(N.C._4); S1 3; S2 4(4_3) 8(8_NC)

### Notes on the sheet
- Sound Effect
  Mute Control
- I2S 3W Class D
  Amplifier and Speaker Output
- (near R4) Amp Gain Selector
  Pos 1: 3dB
  Pos 2: 6dB
  Pos 3: 9dB
  Pos 4: 12dB
  Pos 5: 15dB
- Time Circuit Control - Audio
- TC_CONTROL-000-005
- 1.0

### Library data of the parts
C1 = C0805C104K3RACTU: Capacitor; Manufacturer_Name: Kemet; Datasheet Link: https://componentsearchengine.com/Datasheets/2/C0805C104K3RACTU.pdf; Height: 0.88mm; Manufacturer_Part_Number: C0805C104K3RACTU; Mouser Part Number: 80-C0805C104K3R; Mouser Price/Stock: https://www.mouser.co.uk/ProductDetail/KEMET/C0805C104K3RACTU?qs=zZwvocWqSRjmUvfNxkIN%2Fg%3D%3D; Arrow Part Number: C0805C104K3RACTU; Arrow Price/Stock: https://www.arrow.com/en/products/c0805c104k3ractu/kemet-corporation
C2 = C0805C106K8RACTU: Capacitor; Manufacturer_Name: KEMET; Datasheet Link: https://content.kemet.com/datasheets/KEM_C1002_X7R_SMD.pdf; Height: 1.1mm; Manufacturer_Part_Number: C0805C106K8RACTU; Mouser Part Number: 80-C0805C106K8R; Mouser Price/Stock: https://www.mouser.co.uk/ProductDetail/KEMET/C0805C106K8RACTU?qs=iP0bYSAMAFqUyr6Ql6ZwXw%3D%3D; Arrow Part Number: C0805C106K8RACTU; Arrow Price/Stock: https://www.arrow.com/en/products/c0805c106k8ractu/kemet-corporation?region=nac
C3 = C0805C104K4RACTU: Capacitor; Manufacturer_Name: Kemet; Datasheet Link: http://docs-emea.rs-online.com/webdocs/134c/0900766b8134ce68.pdf; Height: 0.88mm; Manufacturer_Part_Number: C0805C104K4RACTU; Arrow Part Number: C0805C104K4RACTU; Arrow Price/Stock: https://www.arrow.com/en/products/c0805c104k4ractu/kemet-corporation; Mouser Part Number: 80-C0805C104K4R; Mouser Price/Stock: https://www.mouser.co.uk/ProductDetail/KEMET/C0805C104K4RACTU?qs=Pc30aiB8zWWfqQNJWggt%252BA%3D%3D
C4 C5 = C0805C473J8GACAUTO: Capacitor; Manufacturer_Name: KEMET; Datasheet Link: https://content.kemet.com/datasheets/KEM_C1022_C0G_AUTO_SMD.pdf; Height: 1.1mm; Manufacturer_Part_Number: C0805C473J8GACAUTO; Mouser Part Number: 80-C0805C473J8GAUTO; Mouser Price/Stock: https://www.mouser.co.uk/ProductDetail/KEMET/C0805C473J8GACAUTO?qs=ds50AKTGxA9OMfMZaj%2FzcA%3D%3D
IC1 = MAX98357AETE+: Integrated Circuit; Manufacturer_Name: Maxim Integrated; Datasheet Link: https://datasheets.maximintegrated.com/en/ds/MAX98357A-MAX98357B.pdf; Height: 0.8mm; Manufacturer_Part_Number: MAX98357AETE+; Mouser Part Number: 700-MAX98357AETE+; Mouser Price/Stock: https://www.mouser.co.uk/ProductDetail/Maxim-Integrated/MAX98357AETE%2b?qs=AAveGqk956EyS6m3AmZeuw%3D%3D
J1 = 35312-0260: Connector; Manufacturer_Name: Molex; Datasheet Link: https://www.molex.com/pdm_docs/sd/353120260_sd.pdf; Height: 7mm; Manufacturer_Part_Number: 35312-0260; Mouser Part Number: 538-35312-0260; Mouser Price/Stock: https://www.mouser.co.uk/ProductDetail/Molex/35312-0260?qs=yk4OKw9K9iIhFPrGnuA8uA%3D%3D
L1 L2 = 742792023LF: Inductor; Manufacturer_Name: Wurth Elektronik; Datasheet Link: https://www.digikey.in/en/products/detail/w%C3%BCrth-elektronik/742792023/1639017?s=N4IgTCBcDaIOwBYxwJxgAxgMwAIQF0BfIA; Height: 1.1mm; Manufacturer_Part_Number: 742792023LF
R1 = CRCW080510K0FKEAHP: Resistor; Manufacturer_Name: Vishay; Datasheet Link: https://componentsearchengine.com/Datasheets/1/CRCW08051R00FKEAHP.pdf; Height: 0.6mm; Manufacturer_Part_Number: CRCW080510K0FKEAHP; Mouser Part Number: 71-CRCW080510K0FKEAH; Mouser Price/Stock: https://www.mouser.co.uk/ProductDetail/Vishay-Dale/CRCW080510K0FKEAHP/?qs=FlFvgi4rxBybVOW6oiRQjA%3D%3D; Arrow Part Number: CRCW080510K0FKEAHP; Arrow Price/Stock: https://www.arrow.com/en/products/crcw080510k0fkeahp/vishay
R2 = CRCW0805634KFKEA: Resistor; Manufacturer_Name: Vishay; Datasheet Link: http://www.vishay.com/docs/20035/dcrcwe3.pdf; Height: 0.5mm; Manufacturer_Part_Number: CRCW0805634KFKEA; Mouser Part Number: 71-CRCW0805634KFKEA; Mouser Price/Stock: https://www.mouser.com/Search/ProductDetail.aspx?qs=EhwKGB4UJflfbl5wVdh81Q%3d%3d
R3 R4 = CRCW0805100KFKEAC: Resistor; Manufacturer_Name: Vishay; Datasheet Link: https://mouser.componentsearchengine.com/Datasheets/1/CRCW0805100KFKEAC.pdf; Height: 0.6mm; Manufacturer_Part_Number: CRCW0805100KFKEAC; Mouser Part Number: 71-CRCW0805100KFKEAC; Mouser Price/Stock: https://www.mouser.co.uk/ProductDetail/Vishay-Dale/CRCW0805100KFKEAC?qs=E3Y5ESvWgWORJvbAiaO1ug%3D%3D; Arrow Part Number: CRCW0805100KFKEAC; Arrow Price/Stock: https://www.arrow.com/en/products/crcw0805100kfkeac/vishay?region=nac
S1 = MHS12204: Switch; Manufacturer_Name: TE Connectivity; Datasheet Link: https://www.te.com/commerce/DocumentDelivery/DDEController?Action=srchrtrv&DocNm=1825255&DocType=Customer+Drawing&DocLang=English&DocFormat=pdf&PartCntxt=1825255-1; Height: 12mm; Manufacturer_Part_Number: MHS12204; Mouser Part Number: 506-MHS12204; Mouser Price/Stock: https://www.mouser.co.uk/ProductDetail/TE-Connectivity-Alcoswitch/MHS12204?qs=x%2FgbKjZ2T%2FPUluB%2FWhqq0Q%3D%3D; Arrow Part Number: MHS12204; Arrow Price/Stock: https://www.arrow.com/en/products/mhs12204/te-connectivity?region=nac
S2 = SS-10-15SPE: Switch; Manufacturer_Name: Copal Electronics; Datasheet Link: https://www.nidec-copal-electronics.com/e/catalog/switch/ss-10&s-2050.pdf; Height: 7mm; Manufacturer_Part_Number: SS-10-15SPE

## Sheet Level Shifting & Connectors.SchDoc
size A4; SheetNumber: 4; SheetTotal: 9
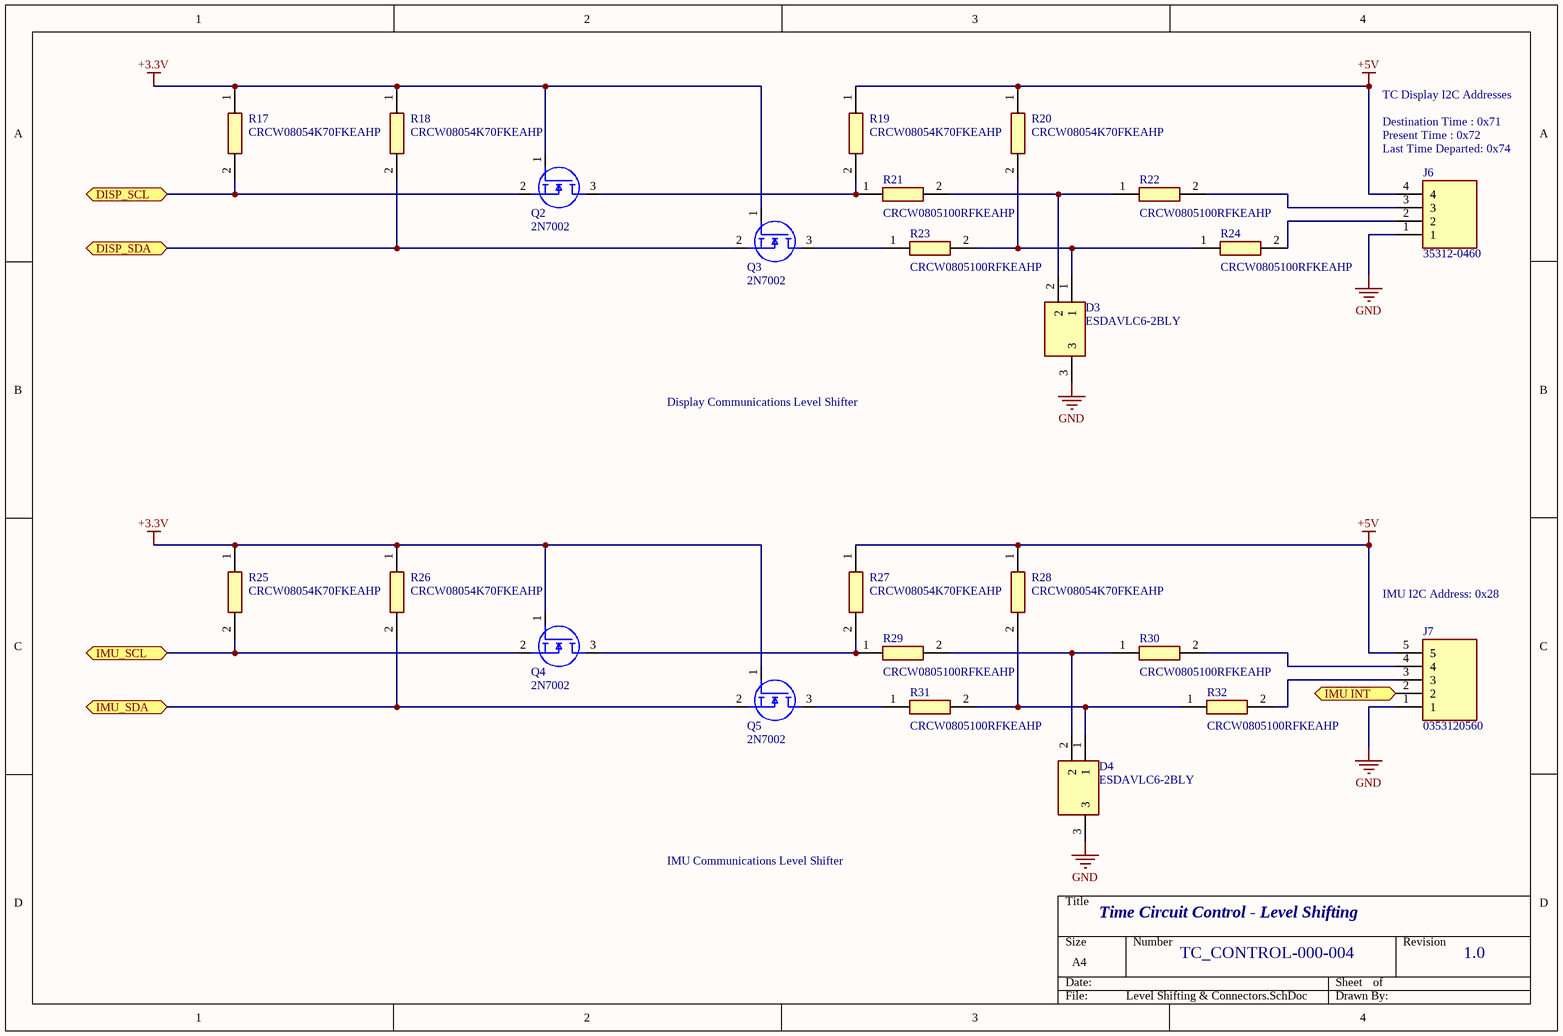
[diagram p7: Level Shifting & Connectors.SchDoc]

### Parts
D3  ESDAVLC6-2BLY  [SOT95P255X150-3N]
D4  ESDAVLC6-2BLY  [SOT95P255X150-3N]
J6  35312-0460  [SHDR4W64P0X250_1X4_1246X650X700P]
J7  0353120560  [0353120560]
Q2  2N7002  [SOT96P240X120-3N]
Q3  2N7002  [SOT96P240X120-3N]
Q4  2N7002  [SOT96P240X120-3N]
Q5  2N7002  [SOT96P240X120-3N]
R17  CRCW08054K70FKEAHP  [RESC2012X50N]
R18  CRCW08054K70FKEAHP  [RESC2012X50N]
R19  CRCW08054K70FKEAHP  [RESC2012X50N]
R20  CRCW08054K70FKEAHP  [RESC2012X50N]
R21  CRCW0805100RFKEAHP  [RESC2012X50N]
R22  CRCW0805100RFKEAHP  [RESC2012X50N]
R23  CRCW0805100RFKEAHP  [RESC2012X50N]
R24  CRCW0805100RFKEAHP  [RESC2012X50N]
R25  CRCW08054K70FKEAHP  [RESC2012X50N]
R26  CRCW08054K70FKEAHP  [RESC2012X50N]
R27  CRCW08054K70FKEAHP  [RESC2012X50N]
R28  CRCW08054K70FKEAHP  [RESC2012X50N]
R29  CRCW0805100RFKEAHP  [RESC2012X50N]
R30  CRCW0805100RFKEAHP  [RESC2012X50N]
R31  CRCW0805100RFKEAHP  [RESC2012X50N]
R32  CRCW0805100RFKEAHP  [RESC2012X50N]

### Ports
DISP_SCL, DISP_SDA, IMU INT, IMU_SCL, IMU_SDA

### Nets
+3.3V: Q2.1(G) Q3.1(G) Q4.1(G) Q5.1(G) R17.1 R18.1 R25.1 R26.1  [project net V_DD_1]
+5V: J6.4 J7.5 R19.1 R20.1 R27.1 R28.1
GND: D3.3 D4.3 J6.1 J7.1  [project net V_SS_1]
I2C1_SCL: Q4.2(S) R25.2 ; port IMU_SCL
I2C1_SDA: Q5.2(S) R26.2 ; port IMU_SDA
I2C3_SCL: Q2.2(S) R17.2 ; port DISP_SCL
I2C3_SDA: Q3.2(S) R18.2 ; port DISP_SDA
PD2: J7.2 ; port IMU INT
NetD3_1: D3.1 R20.2 R23.2 R24.1
NetD3_2: D3.2 R21.2 R22.1
NetD4_1: D4.1 R28.2 R31.2 R32.1
NetD4_2: D4.2 R29.2 R30.1
NetJ6_2: J6.2 R24.2
NetJ6_3: J6.3 R22.2
NetJ7_3: J7.3 R32.2
NetJ7_4: J7.4 R30.2
NetQ2_3: Q2.3(D) R19.2 R21.1
NetQ3_3: Q3.3(D) R23.1
NetQ4_3: Q4.3(D) R27.2 R29.1
NetQ5_3: Q5.3(D) R31.1

### Notes on the sheet
- (near J6) TC Display I2C Addresses
  Destination Time : 0x71
  Present Time : 0x72
  Last Time Departed: 0x74
- Display Communications Level Shifter
- IMU I2C Address: 0x28
- IMU Communications Level Shifter
- Time Circuit Control - Level Shifting
- TC_CONTROL-000-004
- 1.0

### Library data of the parts
D3 D4 = ESDAVLC6-2BLY: TVS Diode (Bi-directional); Manufacturer_Name: STMicroelectronics; Datasheet Link: http://www.st.com/resource/en/datasheet/esdavlc6-2bly.pdf; Height: 1.5mm; Manufacturer_Part_Number: ESDAVLC6-2BLY; Mouser Part Number: 511-ESDAVLC6-2BLY; Mouser Price/Stock: https://www.mouser.co.uk/ProductDetail/STMicroelectronics/ESDAVLC6-2BLY?qs=l7cgNqFNU1iH2e21evvYsA%3D%3D; Arrow Part Number: ESDAVLC6-2BLY; Arrow Price/Stock: https://www.arrow.com/en/products/esdavlc6-2bly/stmicroelectronics
J6 = 35312-0460: Connector; Manufacturer_Name: Molex; Datasheet Link: https://www.molex.com/pdm_docs/sd/353120460_sd.pdf; Height: 7mm; Manufacturer_Part_Number: 35312-0460; Mouser Part Number: 538-35312-0460; Mouser Price/Stock: https://www.mouser.co.uk/ProductDetail/Molex/35312-0460?qs=K5bGVUuM57oIWvCwIBpyrQ%3D%3D
J7 = 0353120560: Connector; Manufacturer_Name: Molex; Datasheet Link: https://www.molex.com/molex/products/part-detail/pcb_headers/0353120560; Height: 7mm; Manufacturer_Part_Number: 0353120560; Mouser Part Number: N/A; Mouser Price/Stock: https://www.mouser.com/Search/Refine.aspx?Keyword=N%2FA; Arrow Part Number: 0353120560; Arrow Price/Stock: https://www.arrow.com/en/products/0353120560/molex
Q2-Q5 = 2N7002: MOSFET (N-Channel); Manufacturer_Name: Vishay; Datasheet Link: https://www.diodes.com/assets/Datasheets/ds11303.pdf; Height: 1.2mm; Manufacturer_Part_Number: 2N7002; Mouser Part Number: 781-2N7002; Mouser Price/Stock: https://www.mouser.co.uk/ProductDetail/Vishay-Siliconix/2N7002?qs=xBpwZ0JX2zKeuvZKtdYLZQ%3D%3D
R17-R20 R25-R28 = CRCW08054K70FKEAHP: Resistor; Manufacturer_Name: Vishay; Datasheet Link: http://uk.rs-online.com/web/p/products/8123574; Height: 0.5mm; Manufacturer_Part_Number: CRCW08054K70FKEAHP; Arrow Part Number: CRCW08054K70FKEAHP; Arrow Price/Stock: https://www.arrow.com/en/products/crcw08054k70fkeahp/vishay; Mouser Part Number: 71-CRCW08054K70FKEAH; Mouser Price/Stock: https://www.mouser.com/Search/Refine.aspx?Keyword=71-CRCW08054K70FKEAH
R21-R24 R29-R32 = CRCW0805100RFKEAHP: Resistor; Manufacturer_Name: Vishay; Datasheet Link: http://uk.rs-online.com/web/p/products/8123362; Height: 0.5mm; Manufacturer_Part_Number: CRCW0805100RFKEAHP; Mouser Part Number: 71-CRCW0805100RFKEAH; Mouser Price/Stock: https://www.mouser.co.uk/ProductDetail/Vishay-Dale/CRCW0805100RFKEAHP?qs=k2%2FDWSARqgHN0DmoUSjg4g%3D%3D; Arrow Part Number: CRCW0805100RFKEAHP; Arrow Price/Stock: https://www.arrow.com/en/products/crcw0805100rfkeahp/vishay?region=nac

## Sheet Indicators & Buttons.SchDoc
size A4; SheetNumber: 8; SheetTotal: 9
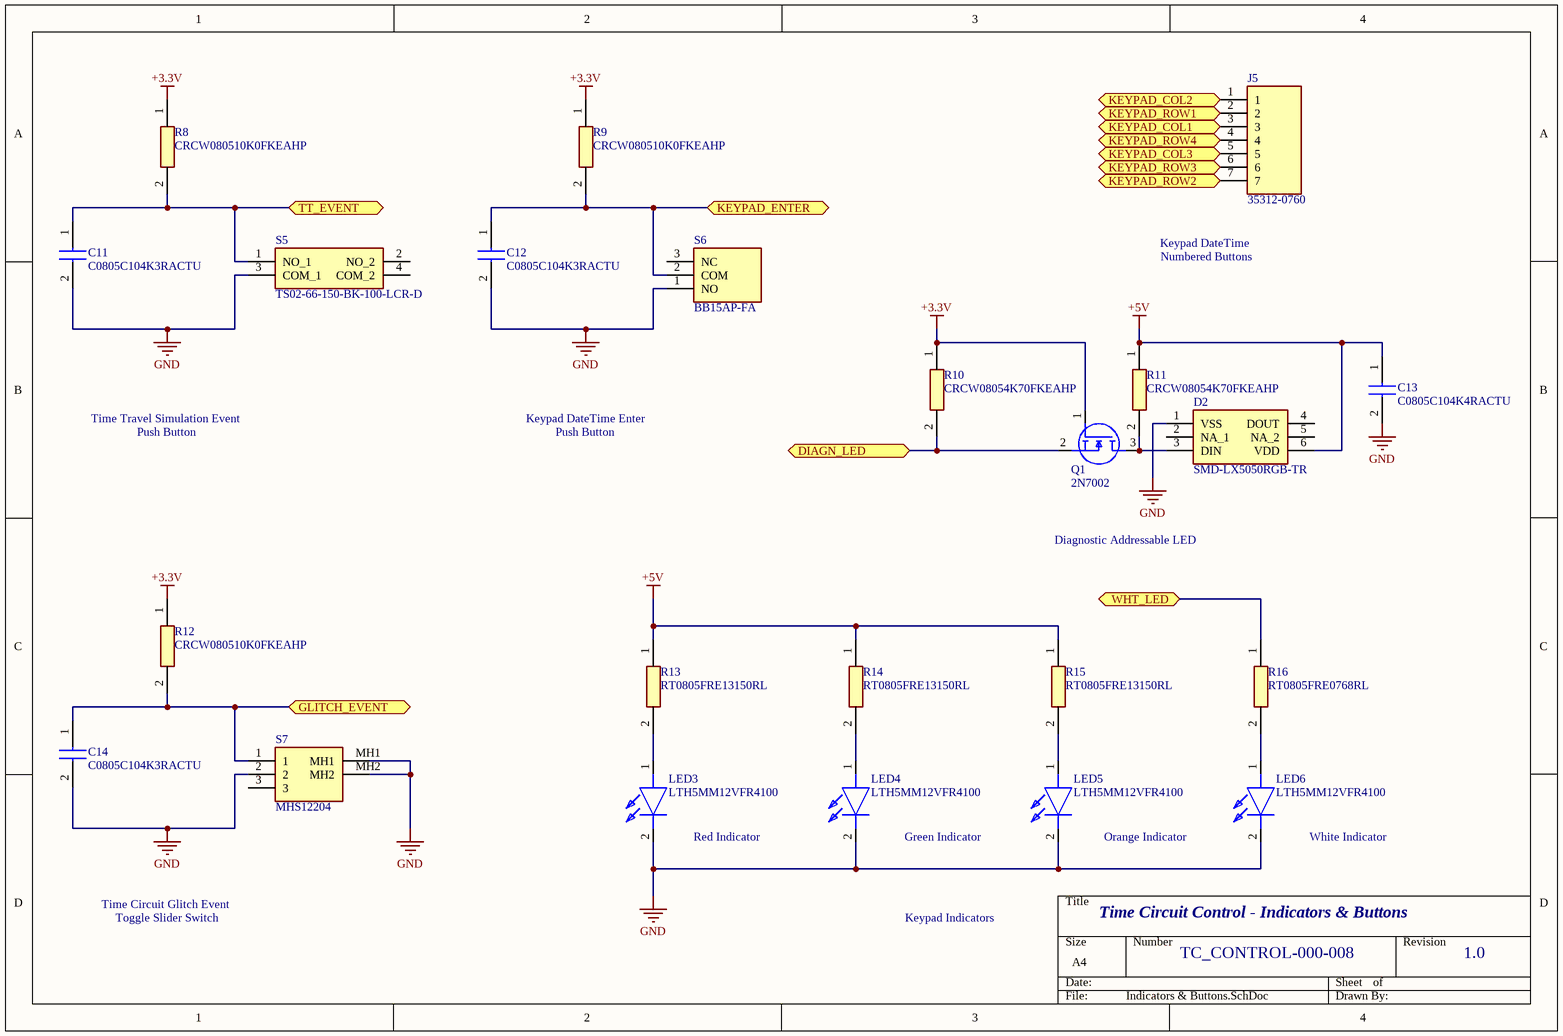
[diagram p8: Indicators & Buttons.SchDoc]

### Parts
C11  C0805C104K3RACTU  [CAPC2012X88N]
C12  C0805C104K3RACTU  [CAPC2012X88N]
C13  C0805C104K4RACTU  [CAPC2012X88N]
C14  C0805C104K3RACTU  [CAPC2012X88N]
D2  SMD-LX5050RGB-TR  [SMDLX5050RGBTR]
J5  35312-0760  [SHDR7W64P0X250_1X7_1996X650X700P]
LED3  LTH5MM12VFR4100  [LTH5MM12VFR4100]
LED4  LTH5MM12VFR4100  [LTH5MM12VFR4100]
LED5  LTH5MM12VFR4100  [LTH5MM12VFR4100]
LED6  LTH5MM12VFR4100  [LTH5MM12VFR4100]
Q1  2N7002  [SOT96P240X120-3N]
R8  CRCW080510K0FKEAHP  [RESC2012X60N]
R9  CRCW080510K0FKEAHP  [RESC2012X60N]
R10  CRCW08054K70FKEAHP  [RESC2012X50N]
R11  CRCW08054K70FKEAHP  [RESC2012X50N]
R12  CRCW080510K0FKEAHP  [RESC2012X60N]
R13  RT0805FRE13150RL  [RESC2012X60N]
R14  RT0805FRE13150RL  [RESC2012X60N]
R15  RT0805FRE13150RL  [RESC2012X60N]
R16  RT0805FRE0768RL  [RESC2012X60N]
S5  TS02-66-150-BK-100-LCR-D  [TS0266150BK100LCRD]
S6  BB15AP-FA  [BB15APFA]
S7  MHS12204  [MHS12204]

### Ports
DIAGN_LED, GLITCH_EVENT, KEYPAD_COL1, KEYPAD_COL2, KEYPAD_COL3, KEYPAD_ENTER, KEYPAD_ROW1, KEYPAD_ROW2, KEYPAD_ROW3, KEYPAD_ROW4, TT_EVENT, WHT_LED

### Nets
+3.3V: Q1.1(G) R8.1 R9.1 R10.1 R12.1  [project net V_DD_1]
+5V: C13.1 D2.6(VDD) R11.1 R13.1 R14.1 R15.1
GND: C11.2 C12.2 C13.2 C14.2 D2.1(VSS) LED3.2(K) LED4.2(K) LED5.2(K) LED6.2(K) S5.3(COM_1) S6.1(NO) S7.2 S7.MH1 S7.MH2  [project net V_SS_1]
PA1: J5.7 ; port KEYPAD_ROW2
PA4: J5.5 ; port KEYPAD_COL3
PB2: C12.1 R9.2 S6.2(COM) ; port KEYPAD_ENTER
PB5: C14.1 R12.2 S7.1 ; port GLITCH_EVENT
PC0: J5.1 ; port KEYPAD_COL2
PC1: J5.2 ; port KEYPAD_ROW1
PC2: J5.3 ; port KEYPAD_COL1
PC3: J5.4 ; port KEYPAD_ROW4
PC4: J5.6 ; port KEYPAD_ROW3
PC11: C11.1 R8.2 S5.1(NO_1) ; port TT_EVENT
PC12: Q1.2(S) R10.2 ; port DIAGN_LED
PC13: R16.1 ; port WHT_LED
NetD2_3: D2.3(DIN) Q1.3(D) R11.2
NetLED3_1: LED3.1(A) R13.2
NetLED4_1: LED4.1(A) R14.2
NetLED5_1: LED5.1(A) R15.2
NetLED6_1: LED6.1(A) R16.2

Not connected (* = marked no-connect by the designer): D2 2(NA_1) 4(DOUT) 5(NA_2); S5 2(NO_2) 4(COM_2); S6 3(NC); S7 3

### Notes on the sheet
- Keypad DateTime
  Numbered Buttons
- Time Travel Simulation Event
  Push Button
- Keypad DateTime Enter
  Push Button
- Diagnostic Addressable LED
- (near LED3) Red Indicator
- (near LED4) Green Indicator
- (near LED5) Orange Indicator
- (near LED6) White Indicator
- Time Circuit Control - Indicators & Buttons
- Time Circuit Glitch Event
  Toggle Slider Switch
- Keypad Indicators
- TC_CONTROL-000-008
- 1.0

### Library data of the parts
C11 C12 C14 = C0805C104K3RACTU: Capacitor; Manufacturer_Name: Kemet; Datasheet Link: https://componentsearchengine.com/Datasheets/2/C0805C104K3RACTU.pdf; Height: 0.88mm; Manufacturer_Part_Number: C0805C104K3RACTU; Mouser Part Number: 80-C0805C104K3R; Mouser Price/Stock: https://www.mouser.co.uk/ProductDetail/KEMET/C0805C104K3RACTU?qs=zZwvocWqSRjmUvfNxkIN%2Fg%3D%3D; Arrow Part Number: C0805C104K3RACTU; Arrow Price/Stock: https://www.arrow.com/en/products/c0805c104k3ractu/kemet-corporation
C13 = C0805C104K4RACTU: Capacitor; Manufacturer_Name: Kemet; Datasheet Link: http://docs-emea.rs-online.com/webdocs/134c/0900766b8134ce68.pdf; Height: 0.88mm; Manufacturer_Part_Number: C0805C104K4RACTU; Arrow Part Number: C0805C104K4RACTU; Arrow Price/Stock: https://www.arrow.com/en/products/c0805c104k4ractu/kemet-corporation; Mouser Part Number: 80-C0805C104K4R; Mouser Price/Stock: https://www.mouser.co.uk/ProductDetail/KEMET/C0805C104K4RACTU?qs=Pc30aiB8zWWfqQNJWggt%252BA%3D%3D
D2 = SMD-LX5050RGB-TR: Diode; Manufacturer_Name: Lumex; Datasheet Link: https://www.lumex.com/datasheet/SMD-LX5050RGB-TR.html; Height: 1.5mm; Manufacturer_Part_Number: SMD-LX5050RGB-TR; Mouser Part Number: 696-SMDLX5050RGBTR; Mouser Price/Stock: https://www.mouser.co.uk/ProductDetail/Lumex/SMD-LX5050RGB-TR?qs=GedFDFLaBXGgyFR6XtWXMw%3D%3D; Arrow Part Number: SMD-LX5050RGB-TR; Arrow Price/Stock: https://www.arrow.com/en/products/smd-lx5050rgb-tr/lumex?region=nac
J5 = 35312-0760: Connector; Manufacturer_Name: Molex; Datasheet Link: https://www.molex.com/pdm_docs/sd/353120760_sd.pdf; Height: 7mm; Manufacturer_Part_Number: 35312-0760; Mouser Part Number: 538-35312-0760; Mouser Price/Stock: https://www.mouser.co.uk/ProductDetail/Molex/35312-0760?qs=yk4OKw9K9iL5%2Fs1BGO8uUw%3D%3D
LED3-LED6 = LTH5MM12VFR4100: LED; Manufacturer_Name: Visual Communications Company; Datasheet Link: https://componentsearchengine.com/Datasheets/2/LTH5MM12VFR4100.pdf; Height: 9.95mm; Manufacturer_Part_Number: LTH5MM12VFR4100; Mouser Part Number: 593-LTH5MM12VFR4100; Mouser Price/Stock: https://www.mouser.co.uk/ProductDetail/VCC/LTH5MM12VFR4100?qs=Mv7BduZupUjLdcSJg07%2F1g%3D%3D
Q1 = 2N7002: as Q2 on sheet Level Shifting & Connectors; Datasheet Link: https://www.diodes.com/assets/Datasheets/ds11303.pdf; Height: 1.2mm; Manufacturer_Part_Number: 2N7002; Mouser Part Number: 781-2N7002; Mouser Price/Stock: https://www.mouser.co.uk/ProductDetail/Vishay-Siliconix/2N7002?qs=xBpwZ0JX2zKeuvZKtdYLZQ%3D%3D
R8 R9 R12 = CRCW080510K0FKEAHP: Resistor; Manufacturer_Name: Vishay; Datasheet Link: https://componentsearchengine.com/Datasheets/1/CRCW08051R00FKEAHP.pdf; Height: 0.6mm; Manufacturer_Part_Number: CRCW080510K0FKEAHP; Mouser Part Number: 71-CRCW080510K0FKEAH; Mouser Price/Stock: https://www.mouser.co.uk/ProductDetail/Vishay-Dale/CRCW080510K0FKEAHP/?qs=FlFvgi4rxBybVOW6oiRQjA%3D%3D; Arrow Part Number: CRCW080510K0FKEAHP; Arrow Price/Stock: https://www.arrow.com/en/products/crcw080510k0fkeahp/vishay
R10 R11 = CRCW08054K70FKEAHP: Resistor; Manufacturer_Name: Vishay; Datasheet Link: http://uk.rs-online.com/web/p/products/8123574; Height: 0.5mm; Manufacturer_Part_Number: CRCW08054K70FKEAHP; Arrow Part Number: CRCW08054K70FKEAHP; Arrow Price/Stock: https://www.arrow.com/en/products/crcw08054k70fkeahp/vishay; Mouser Part Number: 71-CRCW08054K70FKEAH; Mouser Price/Stock: https://www.mouser.com/Search/Refine.aspx?Keyword=71-CRCW08054K70FKEAH
R13-R15 = RT0805FRE13150RL: Resistor; Manufacturer_Name: KEMET; Datasheet Link: https://www.mouser.in/datasheet/2/447/PYu-RT_1-to-0.01_RoHS_L_11-1669912.pdf; Height: 0.6mm; Manufacturer_Part_Number: RT0805FRE13150RL; Mouser Part Number: 603-RT0805FRE13150RL; Mouser Price/Stock: https://www.mouser.co.uk/ProductDetail/Yageo/RT0805FRE13150RL?qs=peXyjxmEyvsJNyiYkUNugw%3D%3D
R16 = RT0805FRE0768RL: Resistor; Manufacturer_Name: KEMET; Datasheet Link: https://www.yageo.com/upload/media/product/productsearch/datasheet/rchip/PYu-RT_1-to-0.01_RoHS_L_11.pdf; Height: 0.6mm; Manufacturer_Part_Number: RT0805FRE0768RL; Mouser Part Number: 603-RT0805FRE0768RL; Mouser Price/Stock: https://www.mouser.co.uk/ProductDetail/Yageo/RT0805FRE0768RL?qs=yNCrj0CQcyKh6OmIHtX6fQ%3D%3D
S5 = TS02-66-150-BK-100-LCR-D: Integrated Circuit; Manufacturer_Name: CUI Inc.; Datasheet Link: https://www.cuidevices.com/product/resource/ts02.pdf; Height: 15.2mm; Manufacturer_Part_Number: TS02-66-150-BK-100-LCR-D; Mouser Part Number: 179-TS0266150BK100LC; Mouser Price/Stock: https://www.mouser.co.uk/ProductDetail/CUI-Devices/TS02-66-150-BK-100-LCR-D?qs=A6eO%252BMLsxmTmMEK2h9yrsA%3D%3D; Arrow Part Number: TS02-66-150-BK-100-LCR-D; Arrow Price/Stock: https://www.arrow.com/en/products/ts02-66-150-bk-100-lcr-d/cui-devices?region=nac
S6 = BB15AP-FA: Switch; Manufacturer_Name: NKK Switches; Datasheet Link: http://www.nkkswitches.com/pdf/Bpushbuttons-1.pdf; Height: 19.4mm; Manufacturer_Part_Number: BB15AP-FA; Mouser Part Number: 633-BB15AP-FA; Mouser Price/Stock: https://www.mouser.co.uk/ProductDetail/NKK-Switches/BB15AP-FA?qs=UTbEi1DBCno08sfAzv%2F1qA%3D%3D; Arrow Part Number: BB15AP-FA; Arrow Price/Stock: https://www.arrow.com/en/products/bb15ap-fa/nkk-switches
S7 = MHS12204: as S1 on sheet Audio; Datasheet Link: https://www.te.com/commerce/DocumentDelivery/DDEController?Action=srchrtrv&DocNm=1825255&DocType=Customer+Drawing&DocLang=English&DocFormat=pdf&PartCntxt=1825255-1; Height: 12mm; Manufacturer_Part_Number: MHS12204; Mouser Part Number: 506-MHS12204; Mouser Price/Stock: https://www.mouser.co.uk/ProductDetail/TE-Connectivity-Alcoswitch/MHS12204?qs=x%2FgbKjZ2T%2FPUluB%2FWhqq0Q%3D%3D; Arrow Part Number: MHS12204; Arrow Price/Stock: https://www.arrow.com/en/products/mhs12204/te-connectivity?region=nac

## Nets that join several sheets
+5V: CAN Communications (C6.1 IC2.3), Core Power (5 pins), Level Shifting & Connectors (6 pins), Indicators & Buttons (6 pins)
V_DD_1: STM32 MCU (14 pins), CAN Communications (6 pins), RTC (C15.1 IC3.2 R33.2), Core Power (C9.1 D1.2 DC1.5 R7.1), SD Card (8 pins), Audio (8 pins), Level Shifting & Connectors (8 pins), Indicators & Buttons (5 pins)
V_SS_1: STM32 MCU (20 pins), CAN Communications (9 pins), RTC (10 pins), Core Power (8 pins), SD Card (6 pins), Audio (14 pins), Level Shifting & Connectors (D3.3 D4.3 J6.1 J7.1), Indicators & Buttons (14 pins)
VBAT EXT_RTC: RTC (IC3.14), Core Power (J9.3)
VBAT MICRO: STM32 MCU (IC4.1), Core Power (J9.1)
ADC1_IN0: STM32 MCU (IC4.14), CAN Communications (RN1.5 S4.5)
CAN_RX: STM32 MCU (IC4.44), CAN Communications (IC2.4)
CAN_TX: STM32 MCU (IC4.45), CAN Communications (IC2.1)
I2C1_SCL: STM32 MCU (IC4.58), Level Shifting & Connectors (Q4.2 R25.2)
I2C1_SDA: STM32 MCU (IC4.59), Level Shifting & Connectors (Q5.2 R26.2)
I2C2_SCL: STM32 MCU (IC4.29), RTC (IC3.16)
I2C2_SDA: STM32 MCU (IC4.30), RTC (IC3.15)
I2C3_SCL: STM32 MCU (IC4.41), Level Shifting & Connectors (Q2.2 R17.2)
I2C3_SDA: STM32 MCU (IC4.40), Level Shifting & Connectors (Q3.2 R18.2)
I2S2_CK: STM32 MCU (IC4.34), Audio (IC1.14)
I2S2_EXT_SD: STM32 MCU (IC4.35), Audio (IC1.4 R2.1)
I2S2_SD: STM32 MCU (IC4.36), Audio (IC1.1)
I2S2_WS: STM32 MCU (IC4.33), Audio (IC1.16)
PA1: STM32 MCU (IC4.15), Indicators & Buttons (J5.7)
PA4: STM32 MCU (IC4.20), Indicators & Buttons (J5.5)
PB0: STM32 MCU (IC4.25), SD Card (J8.P2 R35.2)
PB1: STM32 MCU (IC4.26), SD Card (J8.P9 R39.2)
PB2: STM32 MCU (IC4.27), Indicators & Buttons (C12.1 R9.2 S6.2)
PB5: STM32 MCU (IC4.57), Indicators & Buttons (C14.1 R12.2 S7.1)
PB8: STM32 MCU (IC4.61), RTC (IC3.4)
PB9: STM32 MCU (IC4.62), RTC (IC3.3 R33.1)
PC0: STM32 MCU (IC4.8), Indicators & Buttons (J5.1)
PC1: STM32 MCU (IC4.9), Indicators & Buttons (J5.2)
PC2: STM32 MCU (IC4.10), Indicators & Buttons (J5.3)
PC3: STM32 MCU (IC4.11), Indicators & Buttons (J5.4)
PC4: STM32 MCU (IC4.24), Indicators & Buttons (J5.6)
PC6: STM32 MCU (IC4.37), CAN Communications (RN1.8 S4.8)
PC7: STM32 MCU (IC4.38), CAN Communications (RN1.7 S4.7)
PC8: STM32 MCU (IC4.39), CAN Communications (RN1.6 S4.6)
PC10: STM32 MCU (IC4.51), Audio (C1.1 R1.2 S1.1)
PC11: STM32 MCU (IC4.52), Indicators & Buttons (C11.1 R8.2 S5.1)
PC12: STM32 MCU (IC4.53), Indicators & Buttons (Q1.2 R10.2)
PC13: STM32 MCU (IC4.2), Indicators & Buttons (R16.1)
PD2: STM32 MCU (IC4.54), Level Shifting & Connectors (J7.2)
SPI1_MISO: STM32 MCU (IC4.22), SD Card (J8.P7 R37.2)
SPI1_MOSI: STM32 MCU (IC4.23), SD Card (J8.P3 R36.2)
SPI1_SCK: STM32 MCU (IC4.21), SD Card (J8.P5)